# EAGLE schematic ram (EAGLE 9.0.0)

## Sheet 1 of 2
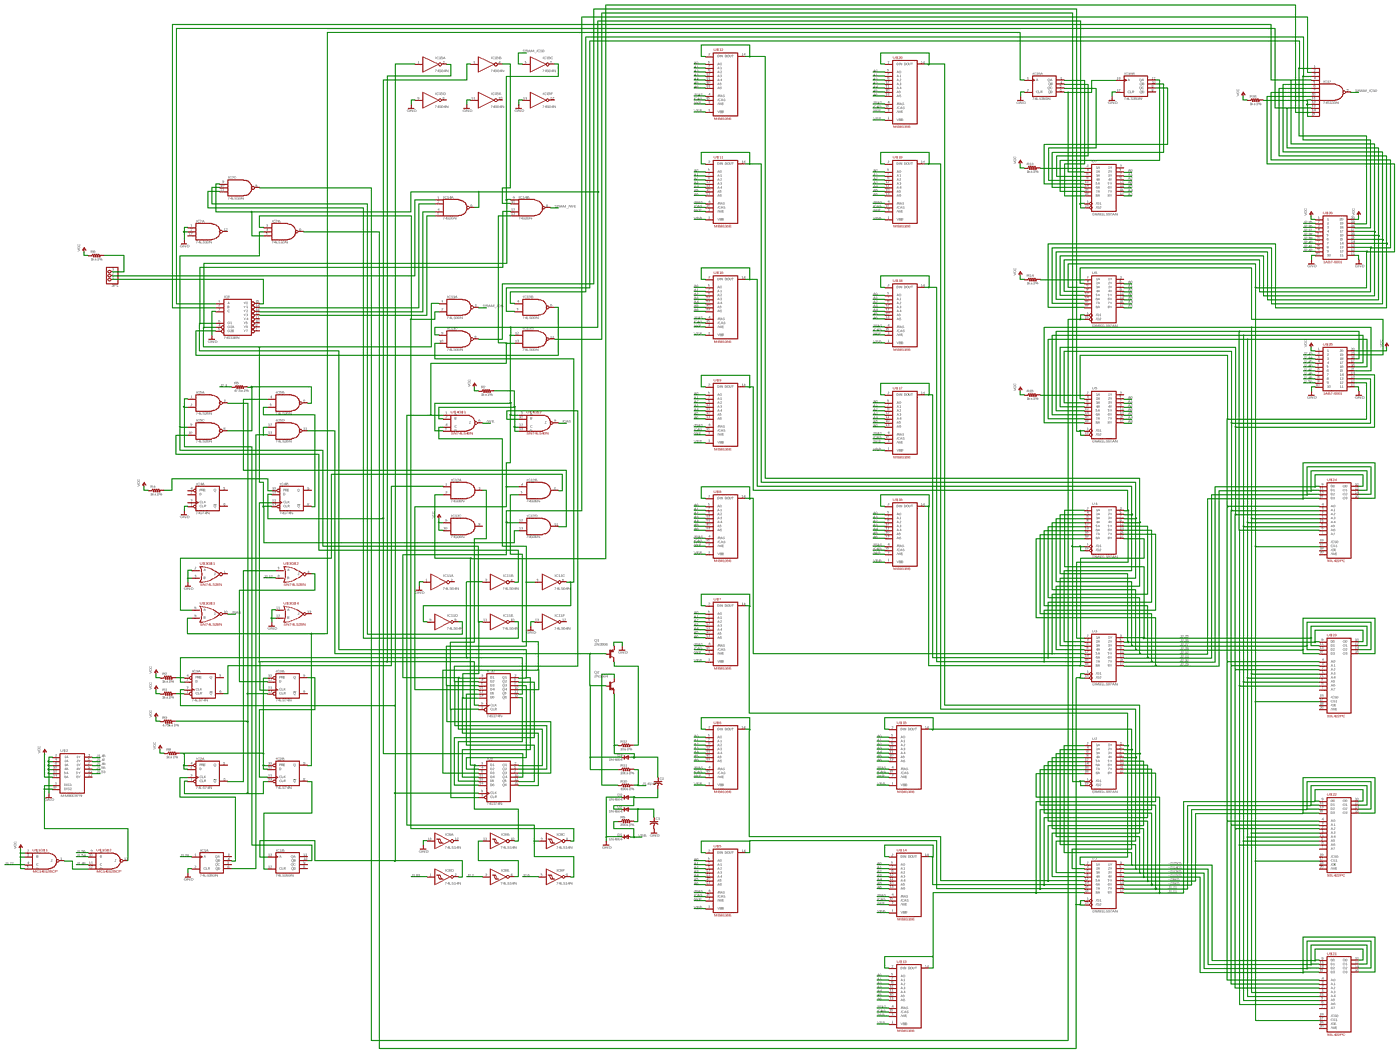
[diagram p0: schematic, sheet 1, overview]
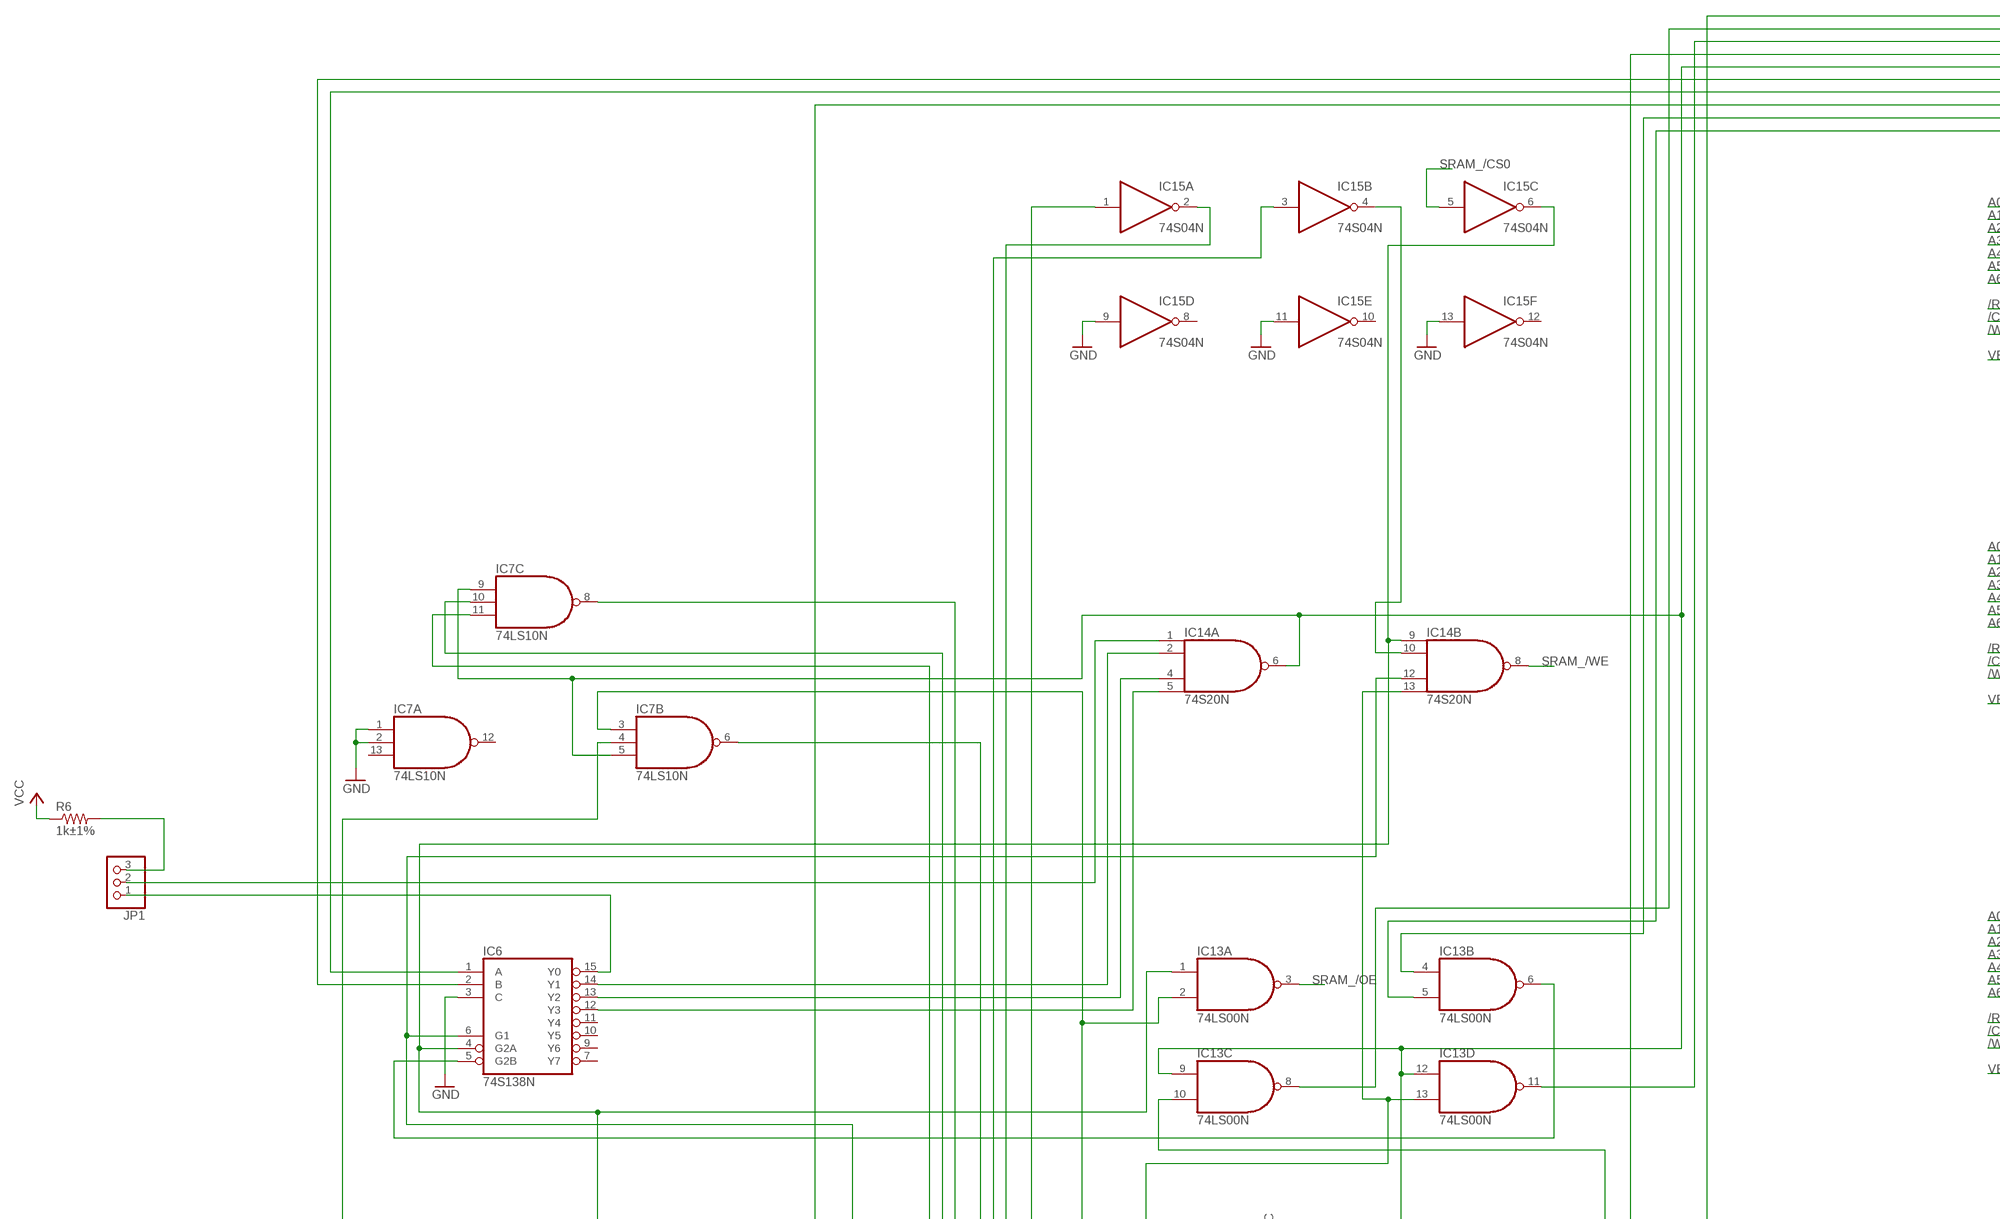
[diagram p1: schematic, sheet 1, part 1 of 4]
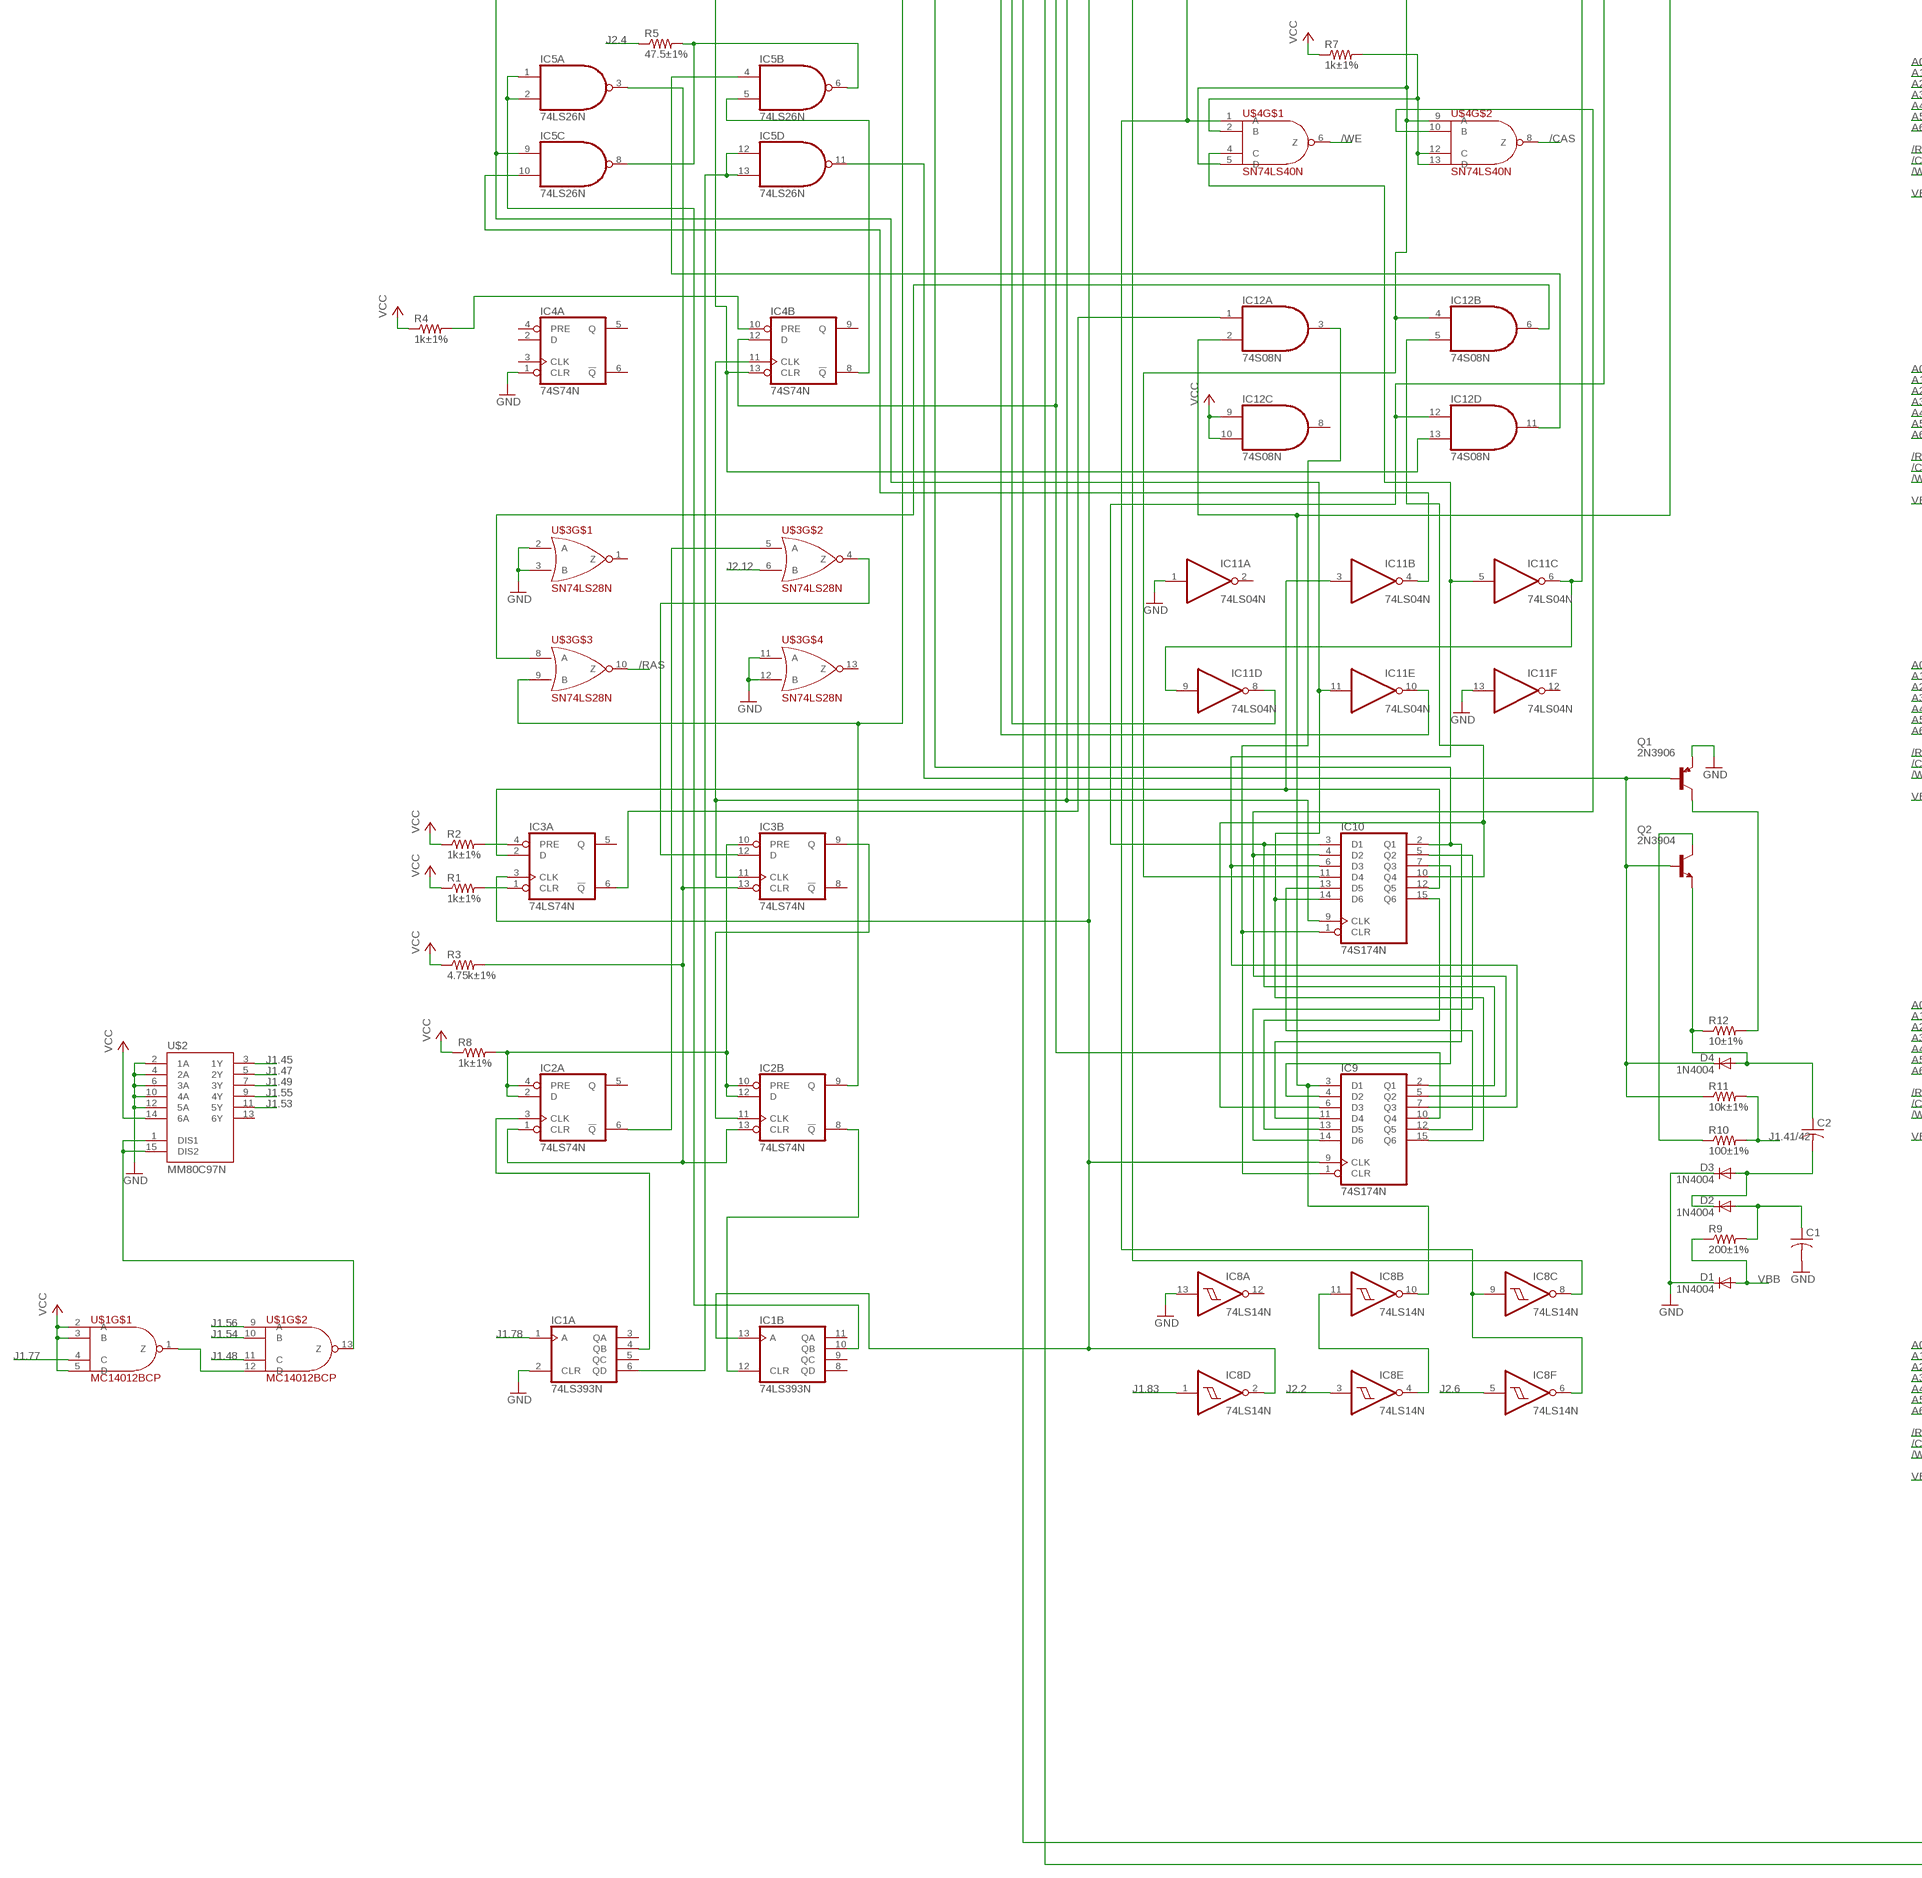
[diagram p2: schematic, sheet 1, part 2 of 4]
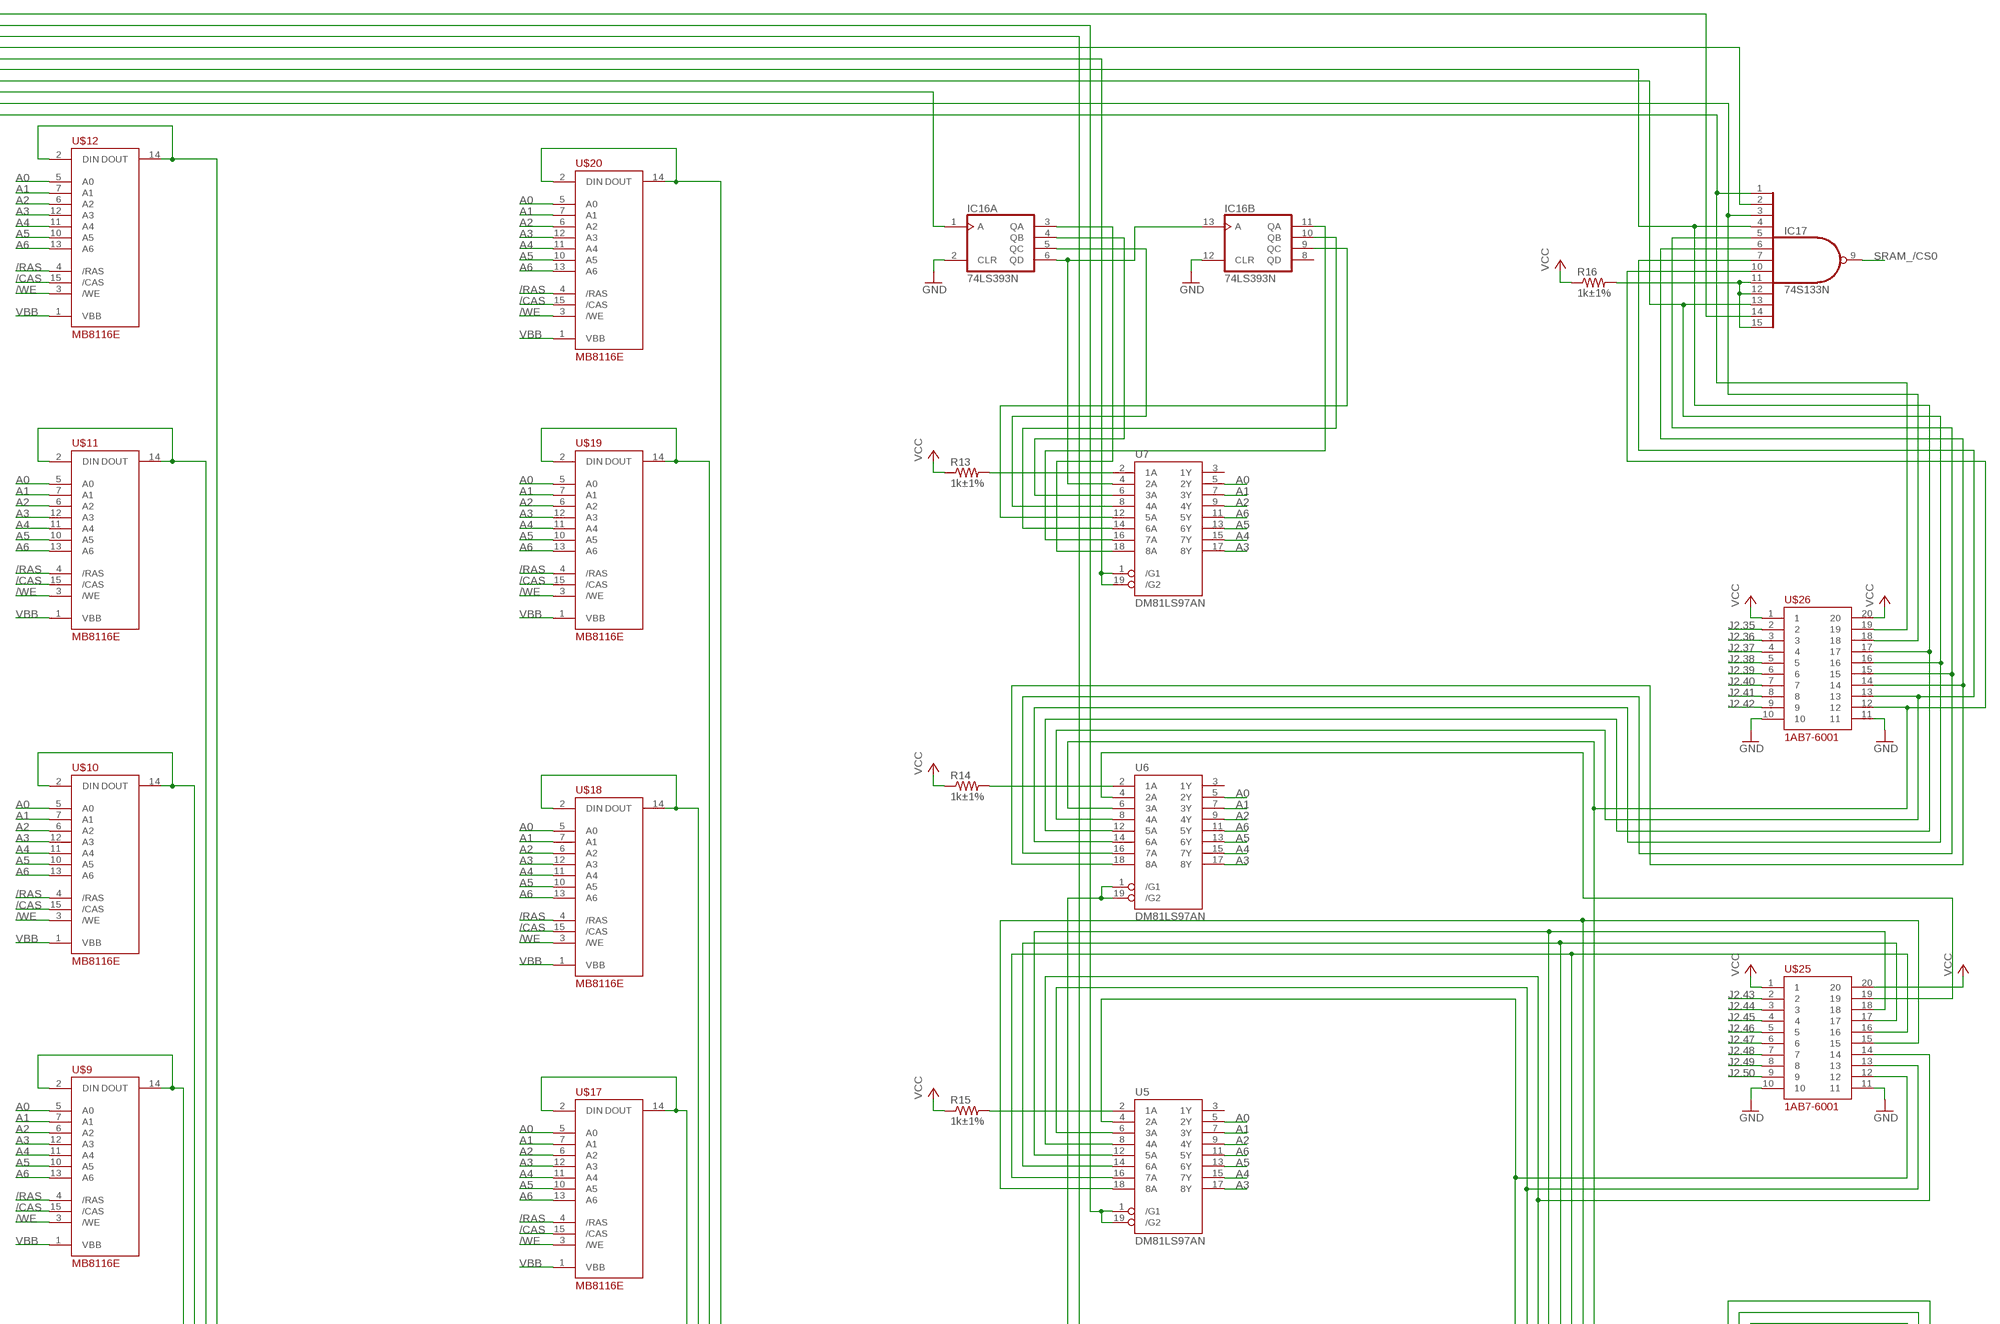
[diagram p3: schematic, sheet 1, part 3 of 4]
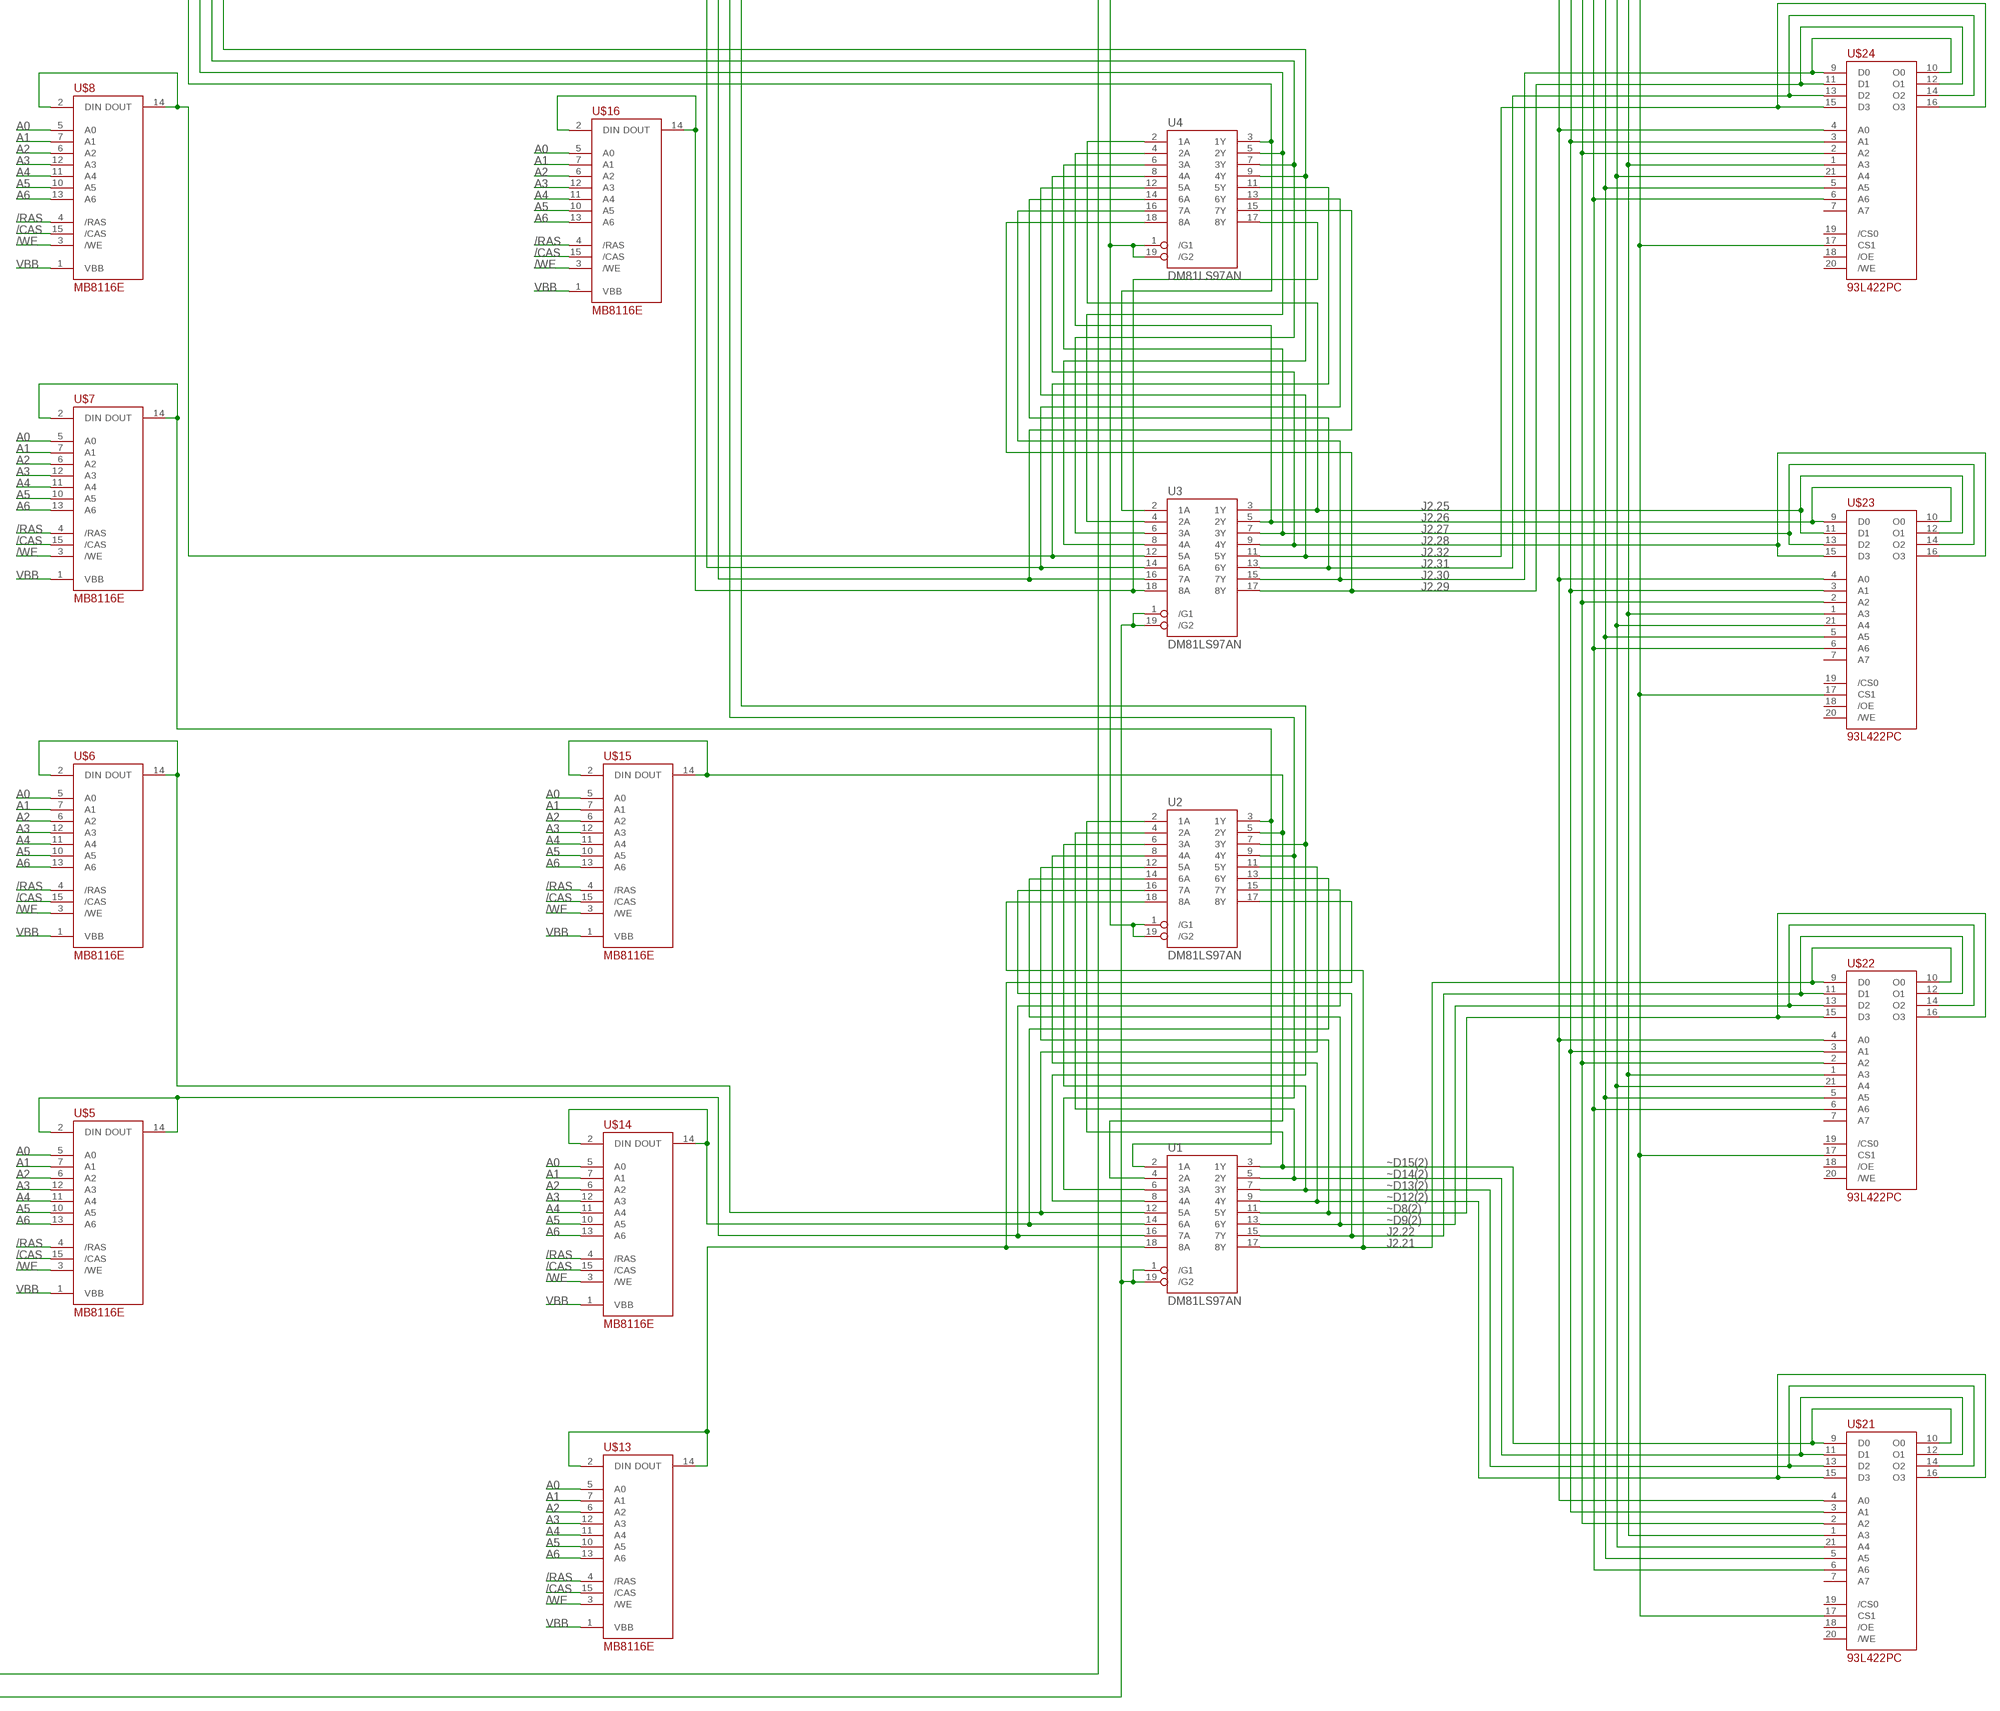
[diagram p4: schematic, sheet 1, part 4 of 4]

### Parts
C1  C-US075-032X103  [C075-032X103]
C2  C-US075-032X103  [C075-032X103]
D1  1N4004  [DO41-10]
D2  1N4004  [DO41-10]
D3  1N4004  [DO41-10]
D4  1N4004  [DO41-10]
IC1  74LS393N  [DIL14]
IC2  74LS74N  [DIL14]
IC3  74LS74N  [DIL14]
IC4  74S74N  [DIL14]
IC5  74LS26N  [DIL14]
IC6  74S138N  [DIL16]
IC7  74LS10N  [DIL14]
IC8  74LS14N  [DIL14]
IC9  74S174N  [DIL16]
IC10  74S174N  [DIL16]
IC11  74LS04N  [DIL14]
IC12  74S08N  [DIL14]
IC13  74LS00N  [DIL14]
IC14  74S20N  [DIL14]
IC15  74S04N  [DIL14]
IC16  74LS393N  [DIL14]
IC17  74S133N  [DIL16]
JP1  PINHD-1X3  [1X03]
Q1  2N3906  [TO92]
Q2  2N3904  [TO92]
R1  1k±1%  R-US_0207/7  [0207/7]
R2  1k±1%  R-US_0207/7  [0207/7]
R3  4.75k±1%  R-US_0207/7  [0207/7]
R4  1k±1%  R-US_0207/7  [0207/7]
R5  47.5±1%  R-US_0207/7  [0207/7]
R6  1k±1%  R-US_0207/7  [0207/7]
R7  1k±1%  R-US_0207/7  [0207/7]
R8  1k±1%  R-US_0207/7  [0207/7]
R9  200±1%  R-US_0207/7  [0207/7]
R10  100±1%  R-US_0207/7  [0207/7]
R11  10k±1%  R-US_0207/7  [0207/7]
R12  10±1%  R-US_0207/7  [0207/7]
R13  1k±1%  R-US_0207/7  [0207/7]
R14  1k±1%  R-US_0207/7  [0207/7]
R15  1k±1%  R-US_0207/7  [0207/7]
R16  1k±1%  R-US_0207/7  [0207/7]
U1  DM81LS97AN  [DIL20]
U2  DM81LS97AN  [DIL20]
U3  DM81LS97AN  [DIL20]
U4  DM81LS97AN  [DIL20]
U5  DM81LS97AN  [DIL20]
U6  DM81LS97AN  [DIL20]
U7  DM81LS97AN  [DIL20]
U$1  MC14012BCP  [DIL14]
U$2  MM80C97N  [DIL16]
U$3  SN74LS28N  [DIL14]
U$4  SN74LS40N  [DIL14]
U$5  MB8116E  [DIL16]
U$6  MB8116E  [DIL16]
U$7  MB8116E  [DIL16]
U$8  MB8116E  [DIL16]
U$9  MB8116E  [DIL16]
U$10  MB8116E  [DIL16]
U$11  MB8116E  [DIL16]
U$12  MB8116E  [DIL16]
U$13  MB8116E  [DIL16]
U$14  MB8116E  [DIL16]
U$15  MB8116E  [DIL16]
U$16  MB8116E  [DIL16]
U$17  MB8116E  [DIL16]
U$18  MB8116E  [DIL16]
U$19  MB8116E  [DIL16]
U$20  MB8116E  [DIL16]
U$21  93L422PC  [DIL22]
U$22  93L422PC  [DIL22]
U$23  93L422PC  [DIL22]
U$24  93L422PC  [DIL22]
U$25  1AB7-6001  [DIL20]
U$26  1AB7-6001  [DIL20]

### Nets
/CAS: U$4.8(Z) U$5.15(/CAS) ; also sheet 2
/RAS: U$3.10(Z) U$5.4(/RAS) ; also sheet 2
/WE: U$4.6(Z) U$5.3(/WE) ; also sheet 2
A0: U5.5(2Y) U6.5(2Y) U7.5(2Y) U$5.5(A0) ; also sheet 2
A1: U5.7(3Y) U6.7(3Y) U7.7(3Y) U$5.7(A1) ; also sheet 2
A2: U5.9(4Y) U6.9(4Y) U7.9(4Y) U$5.6(A2) ; also sheet 2
A3: U5.17(8Y) U6.17(8Y) U7.17(8Y) U$5.12(A3) ; also sheet 2
A4: U5.15(7Y) U6.15(7Y) U7.15(7Y) U$5.11(A4) ; also sheet 2
A5: U5.13(6Y) U6.13(6Y) U7.13(6Y) U$5.10(A5) ; also sheet 2
A6: U5.11(5Y) U6.11(5Y) U7.11(5Y) U$5.13(A6) ; also sheet 2
GND: D1.C D3.C IC1.2(A:CLR) IC4.1(A:CLR) IC6.3(C) IC7.1(A:I0) IC7.2(A:I1) IC8.13(A:I) IC11.1(A:I) IC11.13(F:I) IC15.9(D:I) IC15.11(E:I) IC15.13(F:I) IC16.2(A:CLR) IC16.12(B:CLR) Q1.3(E) U$2.2(1A) U$2.4(2A) U$2.6(3A) U$2.10(4A) U$2.12(5A) U$3.2(A) U$3.3(B) U$3.11(A) U$3.12(B) U$25.11 U$26.11 ; also sheet 2
J1.41/42: R10.2 R11.2
J1.45: U$2.3(1Y)
J1.47: U$2.5(2Y)
J1.48: U$1.11(C)
J1.49: U$2.7(3Y)
J1.53: U$2.11(5Y)
J1.54: U$1.10(B)
J1.55: U$2.9(4Y)
J1.56: U$1.9(A)
J1.77: U$1.4(C)
J1.78: IC1.1(A:A)
J1.83: IC8.1(D:I)
J2.2: IC8.3(E:I)
J2.4: R5.1
J2.6: IC8.5(F:I)
J2.12: U$3.6(B) ; also sheet 2
J2.21: U1.17(8Y) U2.18(8A)
J2.22: U1.15(7Y) U2.16(7A)
J2.25: U3.3(1Y) U4.2(1A)
J2.26: U3.5(2Y) U4.4(2A)
J2.27: U3.7(3Y) U4.6(3A)
J2.28: U3.9(4Y) U4.8(4A)
J2.29: U3.17(8Y) U4.18(8A)
J2.30: U3.15(7Y) U4.16(7A)
J2.31: U3.13(6Y) U4.14(6A)
J2.32: U3.11(5Y) U4.12(5A)
J2.35: U$26.2
J2.36: U$26.3
J2.37: U$26.4
J2.38: U$26.5
J2.39: U$26.6
J2.40: U$26.7
J2.41: U$26.8
J2.42: U$26.9
J2.43: U$25.2
J2.44: U$25.3
J2.45: U$25.4
J2.46: U$25.5
J2.47: U$25.6
J2.48: U$25.7
J2.49: U$25.8
J2.50: U$25.9
N$1: U$1.1(Z) U$1.12(D)
N$2: IC7.6(B:O) U1.1(/G1) U1.19(/G2) U3.1(/G1) U3.19(/G2)
N$3: U$1.13(Z) U$2.1(DIS1) U$2.15(DIS2)
N$4: IC2.2(A:D) IC2.4(A:PRE) IC2.10(B:PRE) IC2.12(B:D) IC3.10(B:PRE) R8.2
N$5: U$25.10
N$6: IC8.10(B:O) IC9.3(D1) IC12.2(A:I1) IC17.14(I11)
N$7: IC2.1(A:CLR) IC2.13(B:CLR) IC3.13(B:CLR) IC5.3(A:O) R3.2
N$8: IC13.11(D:O) U2.1(/G1) U2.19(/G2) U4.1(/G1) U4.19(/G2)
N$9: IC1.10(B:QB) IC5.1(A:I0) IC5.2(A:I1)
N$10: IC5.6(B:O) IC5.8(C:O) R5.2
N$11: IC1.6(A:QD) IC5.12(D:I0) IC5.13(D:I1)
N$12: IC13.8(C:O) U5.1(/G1) U5.19(/G2)
N$13: IC7.8(C:O) U6.1(/G1) U6.19(/G2)
N$14: IC7.5(B:I2) IC7.9(C:I0) IC10.11(D4) IC12.4(B:I0) IC13.9(C:I0) IC13.12(D:I0) IC14.6(A:O) U7.1(/G1) U7.19(/G2) U$4.5(D) U$4.9(A)
N$15: IC8.4(E:O) IC8.11(B:I)
N$16: IC8.6(F:O) IC8.9(C:I) IC13.13(D:I1) IC14.13(B:I3) U$4.1(A)
N$17: IC14.10(B:I1) IC15.4(B:O)
N$18: IC17.10(I7) U6.6(3A) U$21.17(CS1) U$22.17(CS1) U$23.17(CS1) U$24.17(CS1) U$26.12
N$19: IC17.11(I8) IC17.12(I9) IC17.15(I12) R16.2
N$20: IC11.6(C:O) IC11.9(D:I) IC13.10(C:I1)
N$21: R13.2 U7.2(1A)
N$22: R7.2 U$4.2(B) U$4.12(C) U$4.13(D)
N$23: IC13.4(B:I0) IC17.3(I2) U$26.18
N$24: IC13.5(B:I1) IC17.1(I0) U$26.19
N$26: U$26.10
N$41: IC17.7(I6) U6.8(4A) U$26.13
N$42: IC1.12(B:CLR) IC2.8(B:!Q)
N$43: IC1.13(B:A) IC3.3(A:CLK) IC8.2(D:O) IC9.9(CLK) IC15.1(A:I)
N$44: IC12.6(B:O) U$3.8(A)
N$45: IC1.4(A:QB) IC2.3(A:CLK)
N$46: IC2.9(B:Q) IC16.1(A:A) U$3.9(B)
N$47: IC4.8(B:!Q) IC5.5(B:I1)
N$48: IC2.11(B:CLK) IC3.9(B:Q)
N$49: IC2.6(A:!Q) U$3.5(A)
N$50: IC3.1(A:CLR) R1.2
N$51: R2.2
N$52: IC3.6(A:!Q) IC12.1(A:I0)
N$53: IC3.11(B:CLK) IC4.11(B:CLK) IC10.9(CLK) IC15.2(A:O)
N$54: IC4.10(B:PRE) R4.2
N$55: IC3.12(B:D) U$3.4(Z)
N$56: IC3.2(A:D) IC10.12(Q5) IC11.3(B:I)
N$57: IC4.12(B:D) IC9.10(Q4) IC15.3(B:I)
N$58: IC5.9(C:I0) IC7.4(B:I1) IC9.15(Q6) IC10.14(D6) IC11.11(E:I)
N$59: IC4.13(B:CLR) IC6.4(G2A) IC12.13(D:I1) IC13.1(A:I0) IC14.9(B:I0) IC15.6(C:O)
N$60: IC5.4(B:I0) IC12.11(D:O)
N$61: IC5.10(C:I1) IC11.4(B:O)
N$62: D4.C IC5.11(D:O) Q1.2(B) Q2.2(B) R11.1
N$63: IC7.10(C:I1) IC11.8(D:O)
N$66: IC7.11(C:I2) IC11.10(E:O)
N$67: IC9.4(D2) IC10.7(Q3)
N$68: IC6.5(G2B) IC13.6(B:O)
N$69: U1.16(7A) U2.15(7Y) U$5.2(DIN) U$5.14(DOUT)
N$70: IC6.6(G1) IC9.11(D4) IC10.2(Q1) IC14.12(B:I2)
N$71: IC6.12(Y3) IC14.5(A:I3)
N$72: IC6.13(Y2) IC14.4(A:I2)
N$73: IC6.14(Y1) IC14.2(A:I1)
N$74: IC6.15(Y0) JP1.1
N$75: IC14.1(A:I0) JP1.2
N$76: JP1.3 R6.2
N$77: IC9.12(Q5) IC10.13(D5)
N$78: IC7.3(B:I0) IC8.8(C:O) IC13.2(A:I1)
N$79: IC9.13(D5) IC10.15(Q6)
N$80: U1.12(5A) U2.11(5Y)
N$81: U1.2(1A) U2.3(1Y)
N$82: IC9.1(CLR) IC10.1(CLR) IC12.3(A:O)
N$83: IC9.2(Q1) IC10.3(D1) IC12.12(D:I0) IC17.2(I1)
N$84: IC9.5(Q2) IC10.4(D2) U$4.10(B)
N$85: IC9.7(Q3) IC10.6(D3) IC11.5(C:I) U$4.4(C)
N$86: IC9.6(D3) IC10.10(Q4) IC12.5(B:I1)
N$87: IC9.14(D6) IC10.5(Q2)
N$88: U3.12(5A) U4.11(5Y)
N$89: U3.2(1A) U4.3(1Y)
N$91: U3.6(3A) U4.7(3Y)
N$92: U3.8(4A) U4.9(4Y)
N$93: U1.18(8A) U2.17(8Y)
N$94: U1.14(6A) U2.13(6Y)
N$95: U1.4(2A) U2.5(2Y)
N$96: U3.18(8A) U4.17(8Y)
N$97: U3.14(6A) U4.13(6Y)
N$98: U3.16(7A) U4.15(7Y)
N$99: U1.6(3A) U2.9(4Y)
N$100: U1.8(4A) U2.7(3Y)
N$101: C2.1 D4.A Q2.3(E) R12.1
N$102: C1.1 D2.A R9.2
N$103: C2.2 D2.C D3.A
N$104: IC16.6(A:QD) IC16.13(B:A) U7.4(2A)
N$105: IC16.3(A:QA) U7.18(8A)
N$106: Q2.1(C) R10.1
N$107: Q1.1(C) R12.2
N$108: IC16.11(B:QA) U7.16(7A)
N$109: IC16.4(A:QB) U7.6(3A)
N$110: IC16.10(B:QB) U7.14(6A)
N$111: IC16.5(A:QC) U7.8(4A)
N$112: IC16.9(B:QC) U7.12(5A)
N$113: R14.2
N$114: U6.4(2A) U$25.19
N$115: IC6.2(B) IC17.4(I3) U6.12(5A) U$26.17
N$116: IC6.1(A) IC17.13(I10) U6.14(6A) U$26.16
N$117: IC17.5(I4) U6.16(7A) U$26.15
N$118: IC17.6(I5) U6.18(8A) U$26.14
N$119: R15.2
N$120: U5.4(2A) U$21.4(A0) U$22.4(A0) U$23.4(A0) U$24.4(A0) U$25.12
N$121: U5.6(3A) U$21.3(A1) U$22.3(A1) U$23.3(A1) U$24.3(A1) U$25.13
N$123: U5.8(4A) U$21.2(A2) U$22.2(A2) U$23.2(A2) U$24.2(A2) U$25.14
N$124: U5.12(5A) U$21.6(A6) U$22.6(A6) U$23.6(A6) U$24.6(A6) U$25.18
N$125: U5.14(6A) U$21.5(A5) U$22.5(A5) U$23.5(A5) U$24.5(A5) U$25.17
N$126: U5.16(7A) U$21.21(A4) U$22.21(A4) U$23.21(A4) U$24.21(A4) U$25.16
N$127: U5.18(8A) U$21.1(A3) U$22.1(A3) U$23.1(A3) U$24.1(A3) U$25.15
N$130: U3.4(2A) U4.5(2Y)
SRAM_/CS0: IC15.5(C:I) IC17.9(O) ; also sheet 2
SRAM_/OE: IC13.3(A:O) ; also sheet 2
SRAM_/WE: IC14.8(B:O) ; also sheet 2
VBB: D1.A R9.1 U$5.1(VBB) ; also sheet 2
VCC: IC12.9(C:I0) IC12.10(C:I1) R1.1 R2.1 R3.1 R4.1 R6.1 R7.1 R8.1 R13.1 R14.1 R15.1 R16.1 U$1.2(A) U$1.3(B) U$1.5(D) U$2.14(6A) U$25.1 U$25.20 U$26.1 U$26.20 ; also sheet 2
~D8(2): U1.11(5Y) U2.12(5A) ; also sheet 2
~D9(2): U1.13(6Y) U2.14(6A) ; also sheet 2
~D12(2): U1.9(4Y) U2.8(4A) U$21.15(D3) U$21.16(O3) ; also sheet 2
~D13(2): U1.7(3Y) U2.6(3A) U$21.13(D2) U$21.14(O2) ; also sheet 2
~D14(2): U1.5(2Y) U2.4(2A) U$21.11(D1) U$21.12(O1) ; also sheet 2
~D15(2): U1.3(1Y) U2.2(1A) U$21.9(D0) U$21.10(O0) ; also sheet 2
Unconnected: C1.2 IC1.3(A:QA) IC1.5(A:QC) IC1.8(B:QD) IC1.9(B:QC) IC1.11(B:QA) IC2.5(A:Q) IC3.4(A:PRE) IC3.5(A:Q) IC3.8(B:!Q) IC4.2(A:D) IC4.3(A:CLK) IC4.4(A:PRE) IC4.5(A:Q) IC4.6(A:!Q) IC4.9(B:Q) IC6.7(Y7) IC6.9(Y6) IC6.10(Y5) IC6.11(Y4) IC7.12(A:O) IC7.13(A:I2) IC8.12(A:O) IC11.2(A:O) IC11.12(F:O) IC12.8(C:O) IC15.8(D:O) IC15.10(E:O) IC15.12(F:O) IC16.8(B:QD) U5.2(1A) U5.3(1Y) U6.2(1A) U6.3(1Y) U7.3(1Y) U$2.13(6Y) U$3.1(Z) U$3.13(Z) U$6.1(VBB) U$6.2(DIN) U$6.3(/WE) U$6.4(/RAS) U$6.5(A0) U$6.6(A2) U$6.7(A1) U$6.10(A5) U$6.11(A4) U$6.12(A3) U$6.13(A6) U$6.14(DOUT) U$6.15(/CAS) U$7.1(VBB) U$7.2(DIN) U$7.3(/WE) U$7.4(/RAS) U$7.5(A0) U$7.6(A2) U$7.7(A1) U$7.10(A5) U$7.11(A4) U$7.12(A3) U$7.13(A6) U$7.14(DOUT) U$7.15(/CAS) U$8.1(VBB) U$8.2(DIN) U$8.3(/WE) U$8.4(/RAS) U$8.5(A0) U$8.6(A2) U$8.7(A1) U$8.10(A5) U$8.11(A4) U$8.12(A3) U$8.13(A6) U$8.14(DOUT) U$8.15(/CAS) U$9.1(VBB) U$9.2(DIN) U$9.3(/WE) U$9.4(/RAS) U$9.5(A0) U$9.6(A2) U$9.7(A1) U$9.10(A5) U$9.11(A4) U$9.12(A3) U$9.13(A6) U$9.14(DOUT) U$9.15(/CAS) U$10.1(VBB) U$10.2(DIN) U$10.3(/WE) U$10.4(/RAS) U$10.5(A0) U$10.6(A2) U$10.7(A1) U$10.10(A5) U$10.11(A4) U$10.12(A3) U$10.13(A6) U$10.14(DOUT) U$10.15(/CAS) U$11.1(VBB) U$11.2(DIN) U$11.3(/WE) U$11.4(/RAS) U$11.5(A0) U$11.6(A2) U$11.7(A1) U$11.10(A5) U$11.11(A4) U$11.12(A3) U$11.13(A6) U$11.14(DOUT) U$11.15(/CAS) U$12.1(VBB) U$12.2(DIN) U$12.3(/WE) U$12.4(/RAS) U$12.5(A0) U$12.6(A2) U$12.7(A1) U$12.10(A5) U$12.11(A4) U$12.12(A3) U$12.13(A6) U$12.14(DOUT) U$12.15(/CAS) U$13.1(VBB) U$13.2(DIN) U$13.3(/WE) U$13.4(/RAS) U$13.5(A0) U$13.6(A2) U$13.7(A1) U$13.10(A5) U$13.11(A4) U$13.12(A3) U$13.13(A6) U$13.14(DOUT) U$13.15(/CAS) U$14.1(VBB) U$14.2(DIN) U$14.3(/WE) U$14.4(/RAS) U$14.5(A0) U$14.6(A2) U$14.7(A1) U$14.10(A5) U$14.11(A4) U$14.12(A3) U$14.13(A6) U$14.14(DOUT) U$14.15(/CAS) U$15.1(VBB) U$15.2(DIN) U$15.3(/WE) U$15.4(/RAS) U$15.5(A0) U$15.6(A2) U$15.7(A1) U$15.10(A5) U$15.11(A4) U$15.12(A3) U$15.13(A6) U$15.14(DOUT) U$15.15(/CAS) U$16.1(VBB) U$16.2(DIN) U$16.3(/WE) U$16.4(/RAS) U$16.5(A0) U$16.6(A2) U$16.7(A1) U$16.10(A5) U$16.11(A4) U$16.12(A3) U$16.13(A6) U$16.14(DOUT) U$16.15(/CAS) U$17.1(VBB) U$17.2(DIN) U$17.3(/WE) U$17.4(/RAS) U$17.5(A0) U$17.6(A2) U$17.7(A1) U$17.10(A5) U$17.11(A4) U$17.12(A3) U$17.13(A6) U$17.14(DOUT) U$17.15(/CAS) U$18.1(VBB) U$18.2(DIN) U$18.3(/WE) U$18.4(/RAS) U$18.5(A0) U$18.6(A2) U$18.7(A1) U$18.10(A5) U$18.11(A4) U$18.12(A3) U$18.13(A6) U$18.14(DOUT) U$18.15(/CAS) U$19.1(VBB) U$19.2(DIN) U$19.3(/WE) U$19.4(/RAS) U$19.5(A0) U$19.6(A2) U$19.7(A1) U$19.10(A5) U$19.11(A4) U$19.12(A3) U$19.13(A6) U$19.14(DOUT) U$19.15(/CAS) U$20.1(VBB) U$20.2(DIN) U$20.3(/WE) U$20.4(/RAS) U$20.5(A0) U$20.6(A2) U$20.7(A1) U$20.10(A5) U$20.11(A4) U$20.12(A3) U$20.13(A6) U$20.14(DOUT) U$20.15(/CAS) U$21.7(A7) U$21.18(/OE) U$21.19(/CS0) U$21.20(/WE) U$22.7(A7) U$22.9(D0) U$22.10(O0) U$22.11(D1) U$22.12(O1) U$22.13(D2) U$22.14(O2) U$22.15(D3) U$22.16(O3) U$22.18(/OE) U$22.19(/CS0) U$22.20(/WE) U$23.7(A7) U$23.9(D0) U$23.10(O0) U$23.11(D1) U$23.12(O1) U$23.13(D2) U$23.14(O2) U$23.15(D3) U$23.16(O3) U$23.18(/OE) U$23.19(/CS0) U$23.20(/WE) U$24.7(A7) U$24.9(D0) U$24.10(O0) U$24.11(D1) U$24.12(O1) U$24.13(D2) U$24.14(O2) U$24.15(D3) U$24.16(O3) U$24.18(/OE) U$24.19(/CS0) U$24.20(/WE)

## Sheet 2 of 2
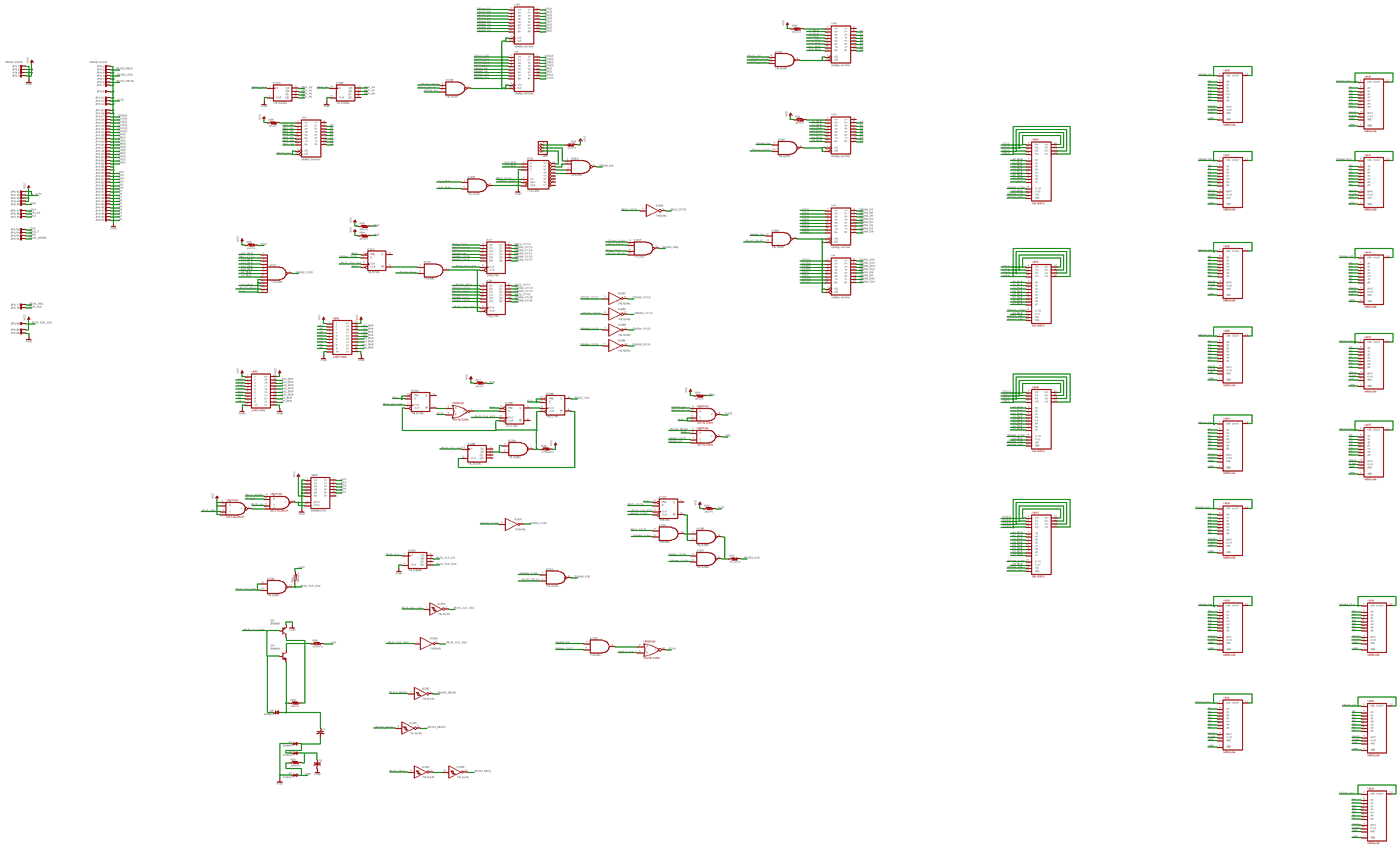
[diagram p5: schematic, sheet 2, overview]
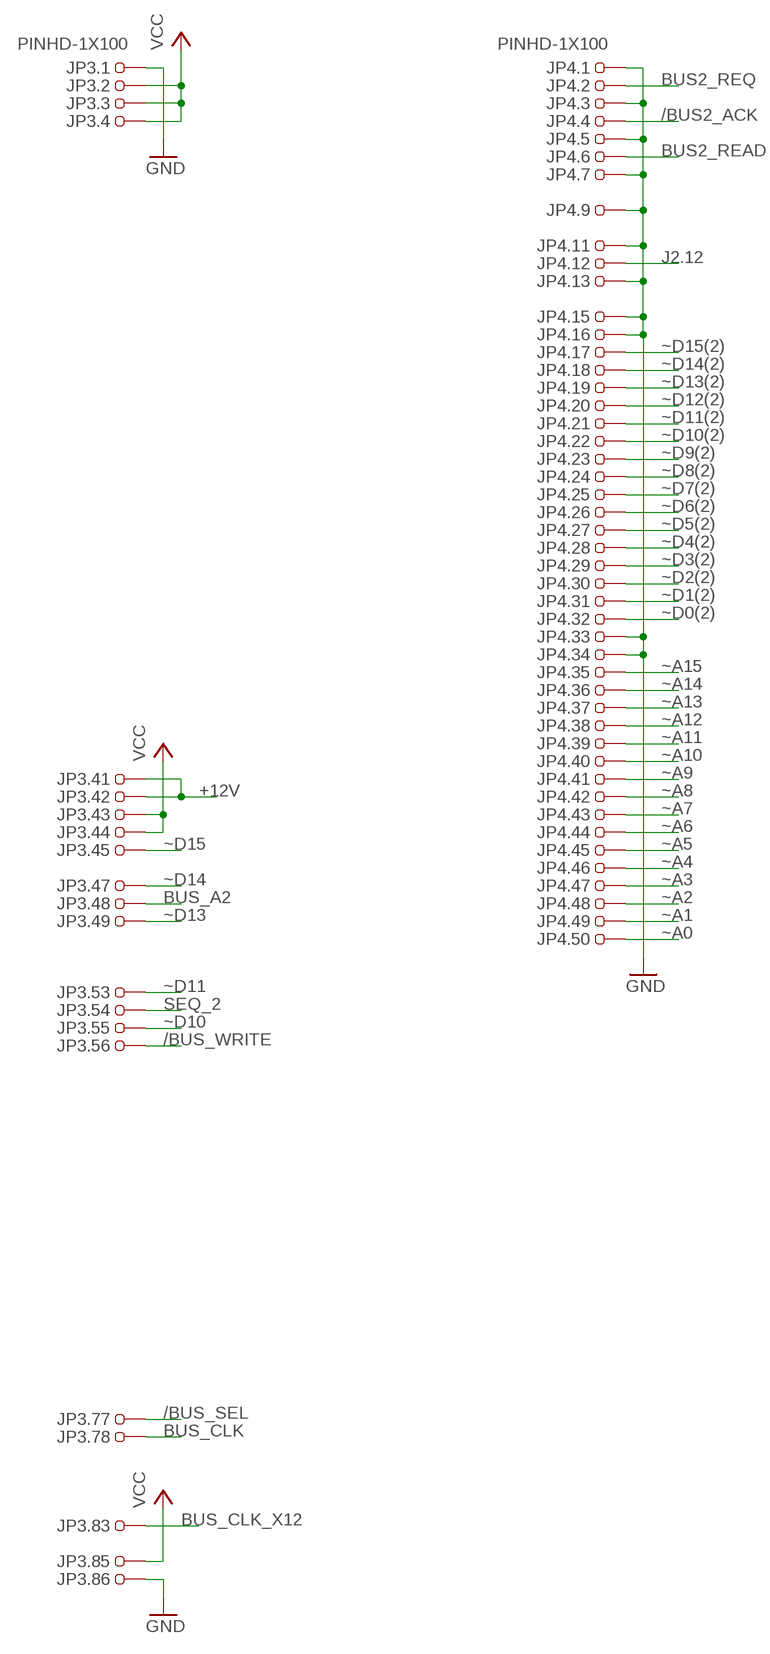
[diagram p6: schematic, sheet 2, part 1 of 7]
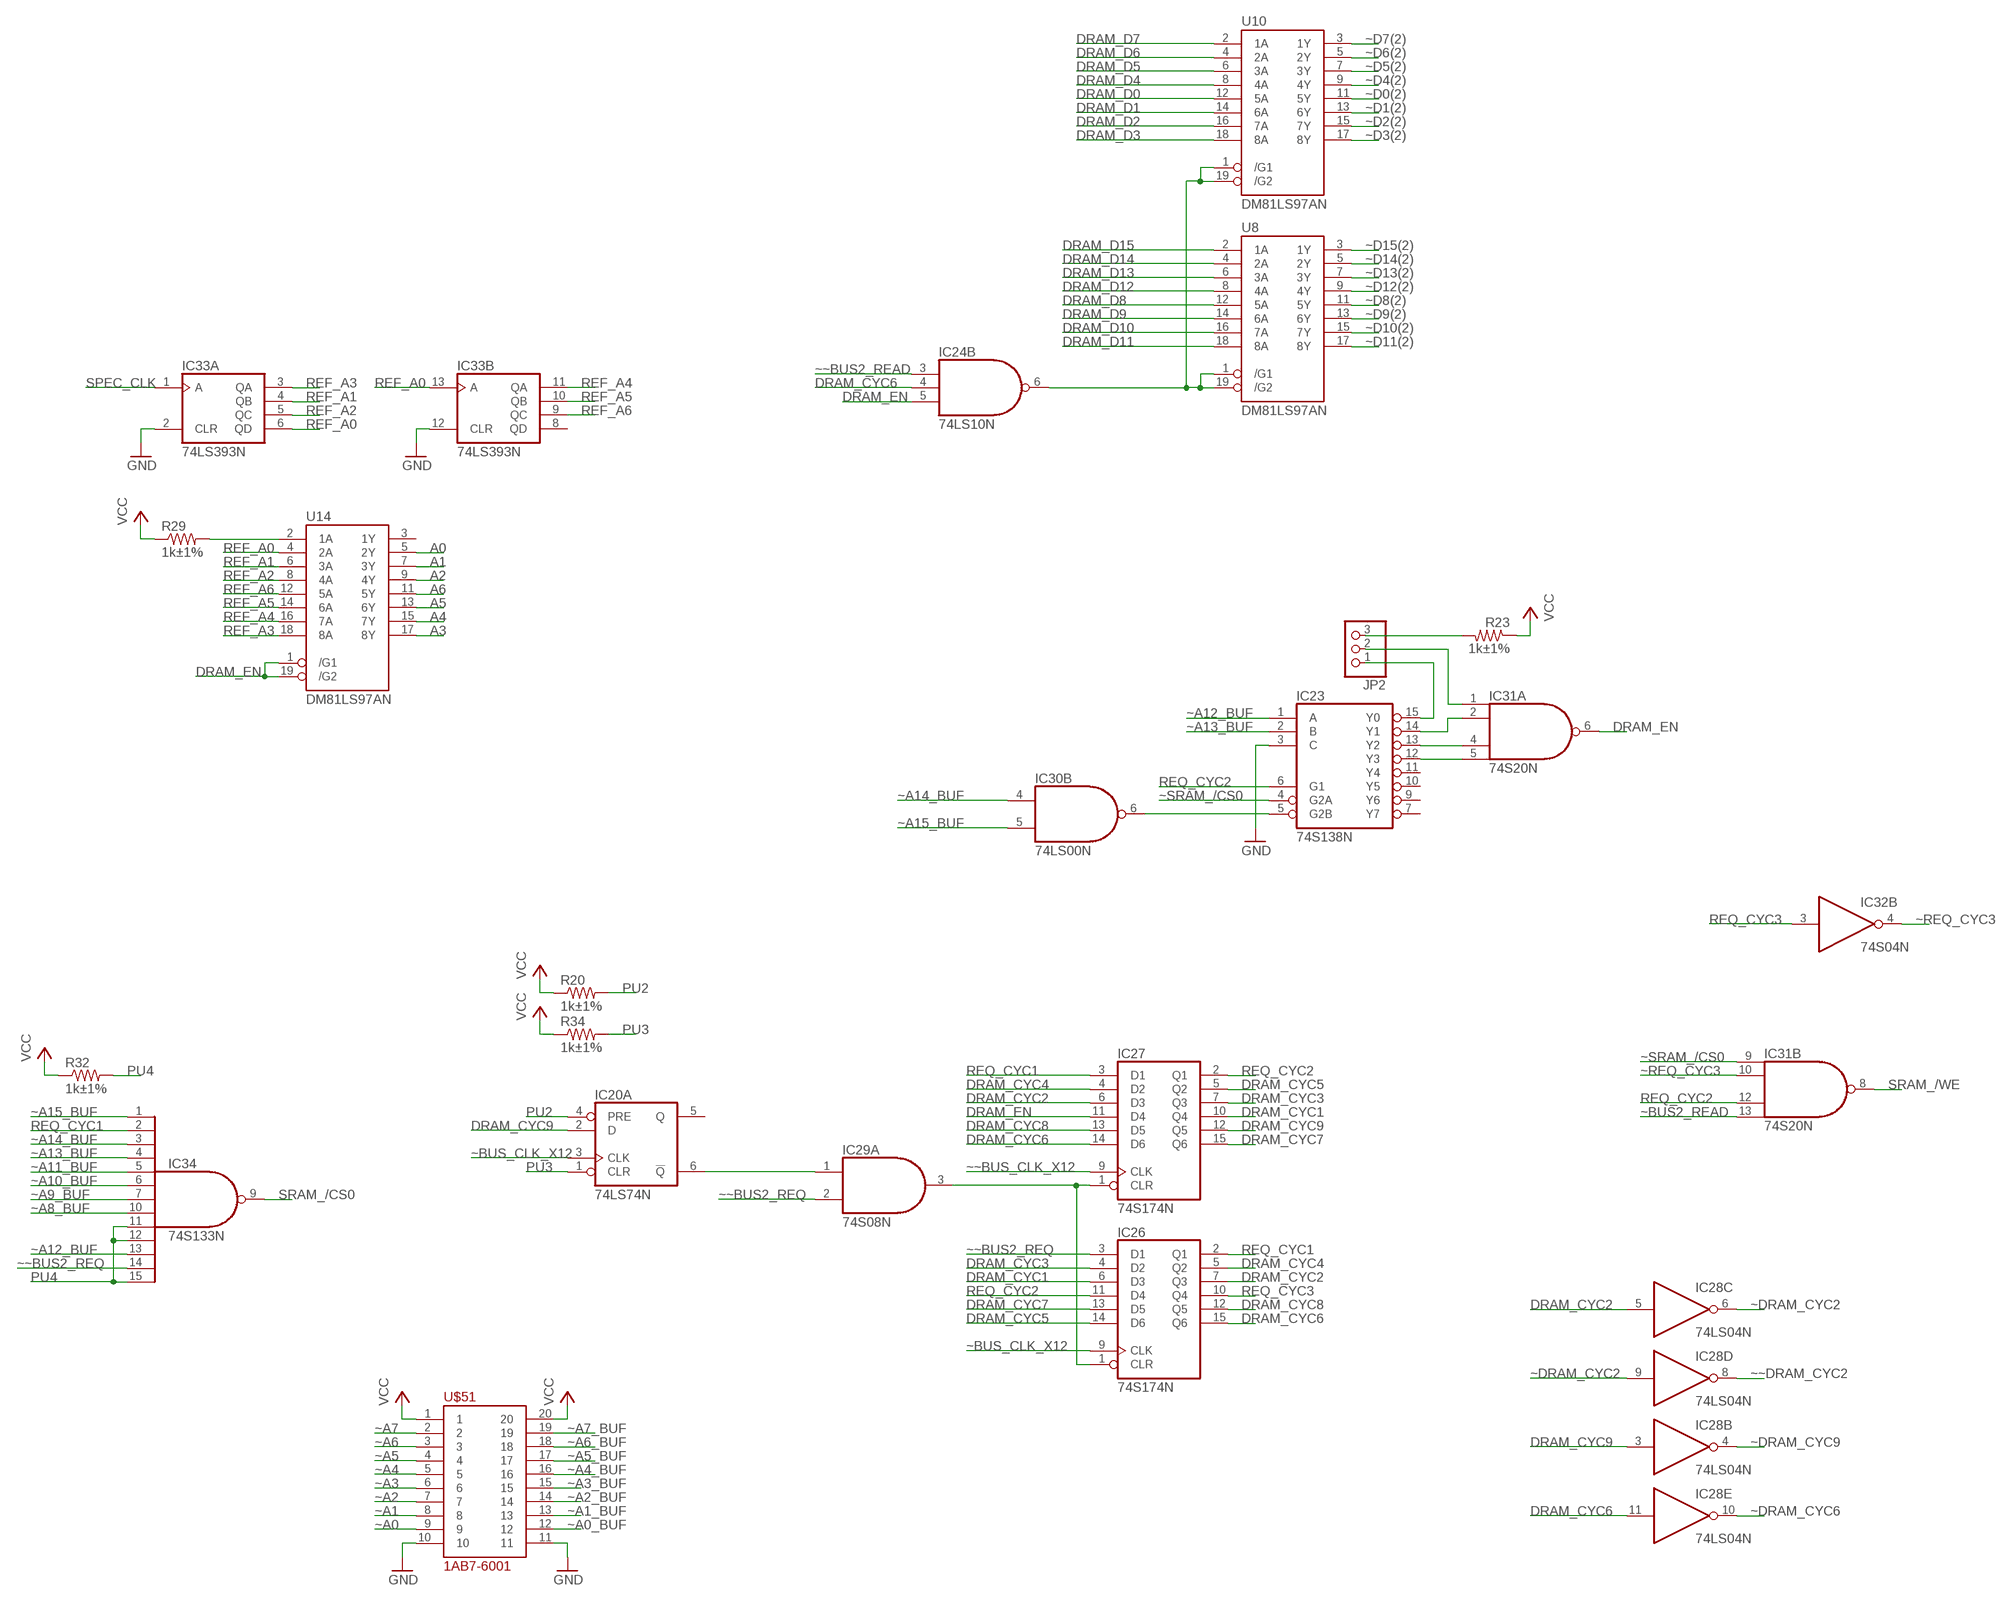
[diagram p7: schematic, sheet 2, part 2 of 7]
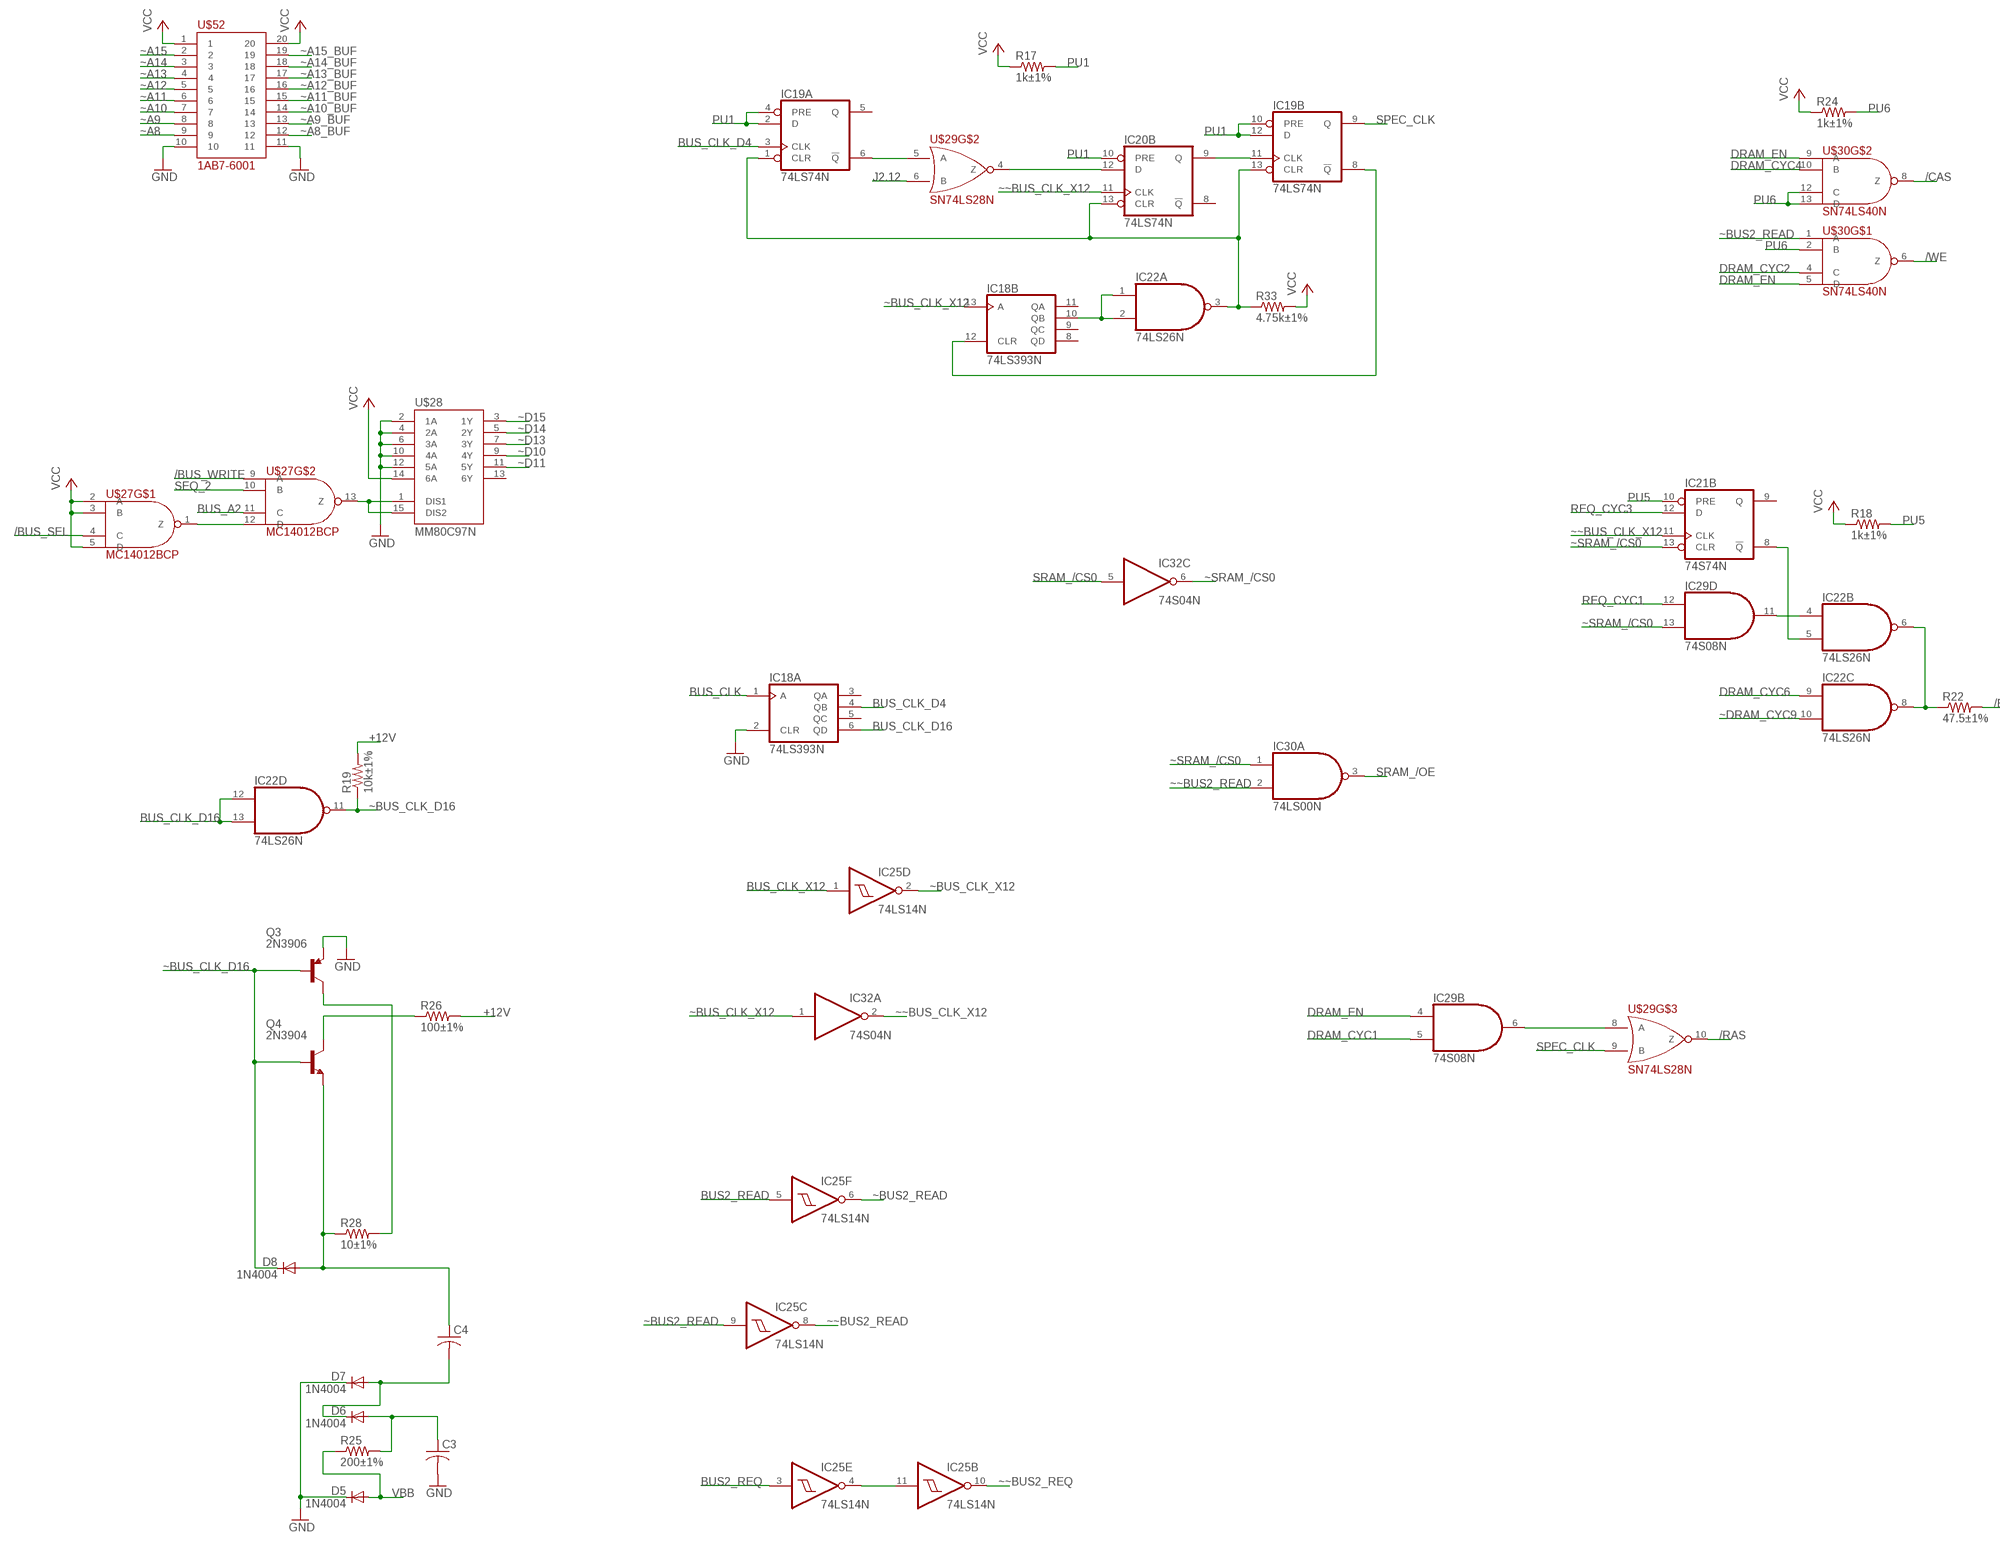
[diagram p8: schematic, sheet 2, part 3 of 7]
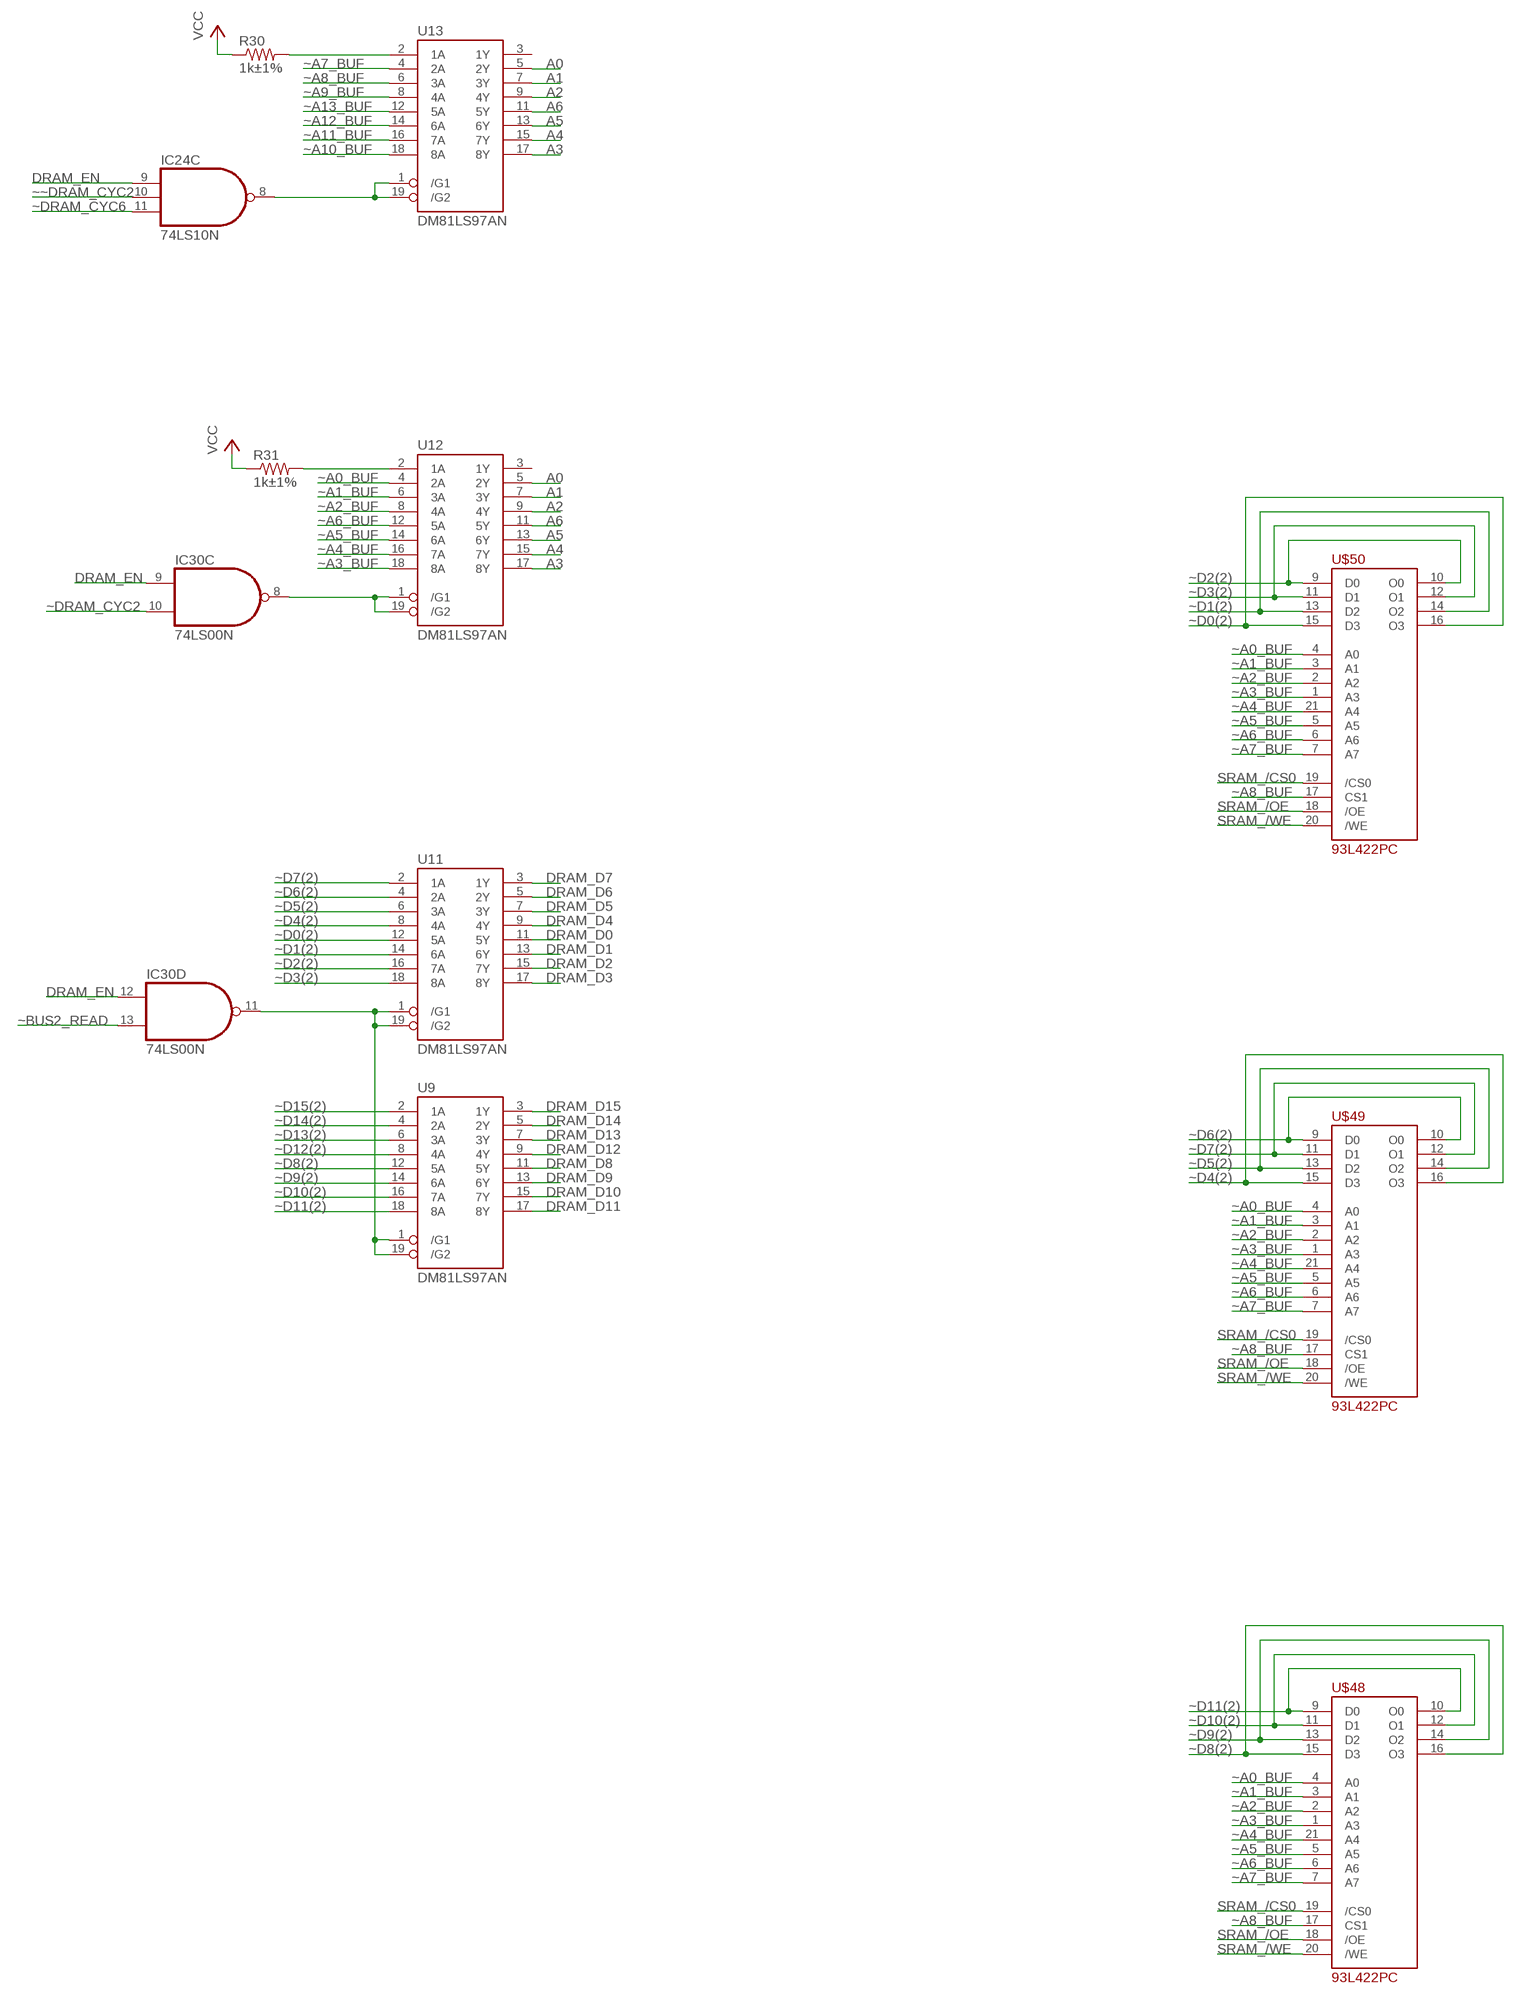
[diagram p9: schematic, sheet 2, part 4 of 7]
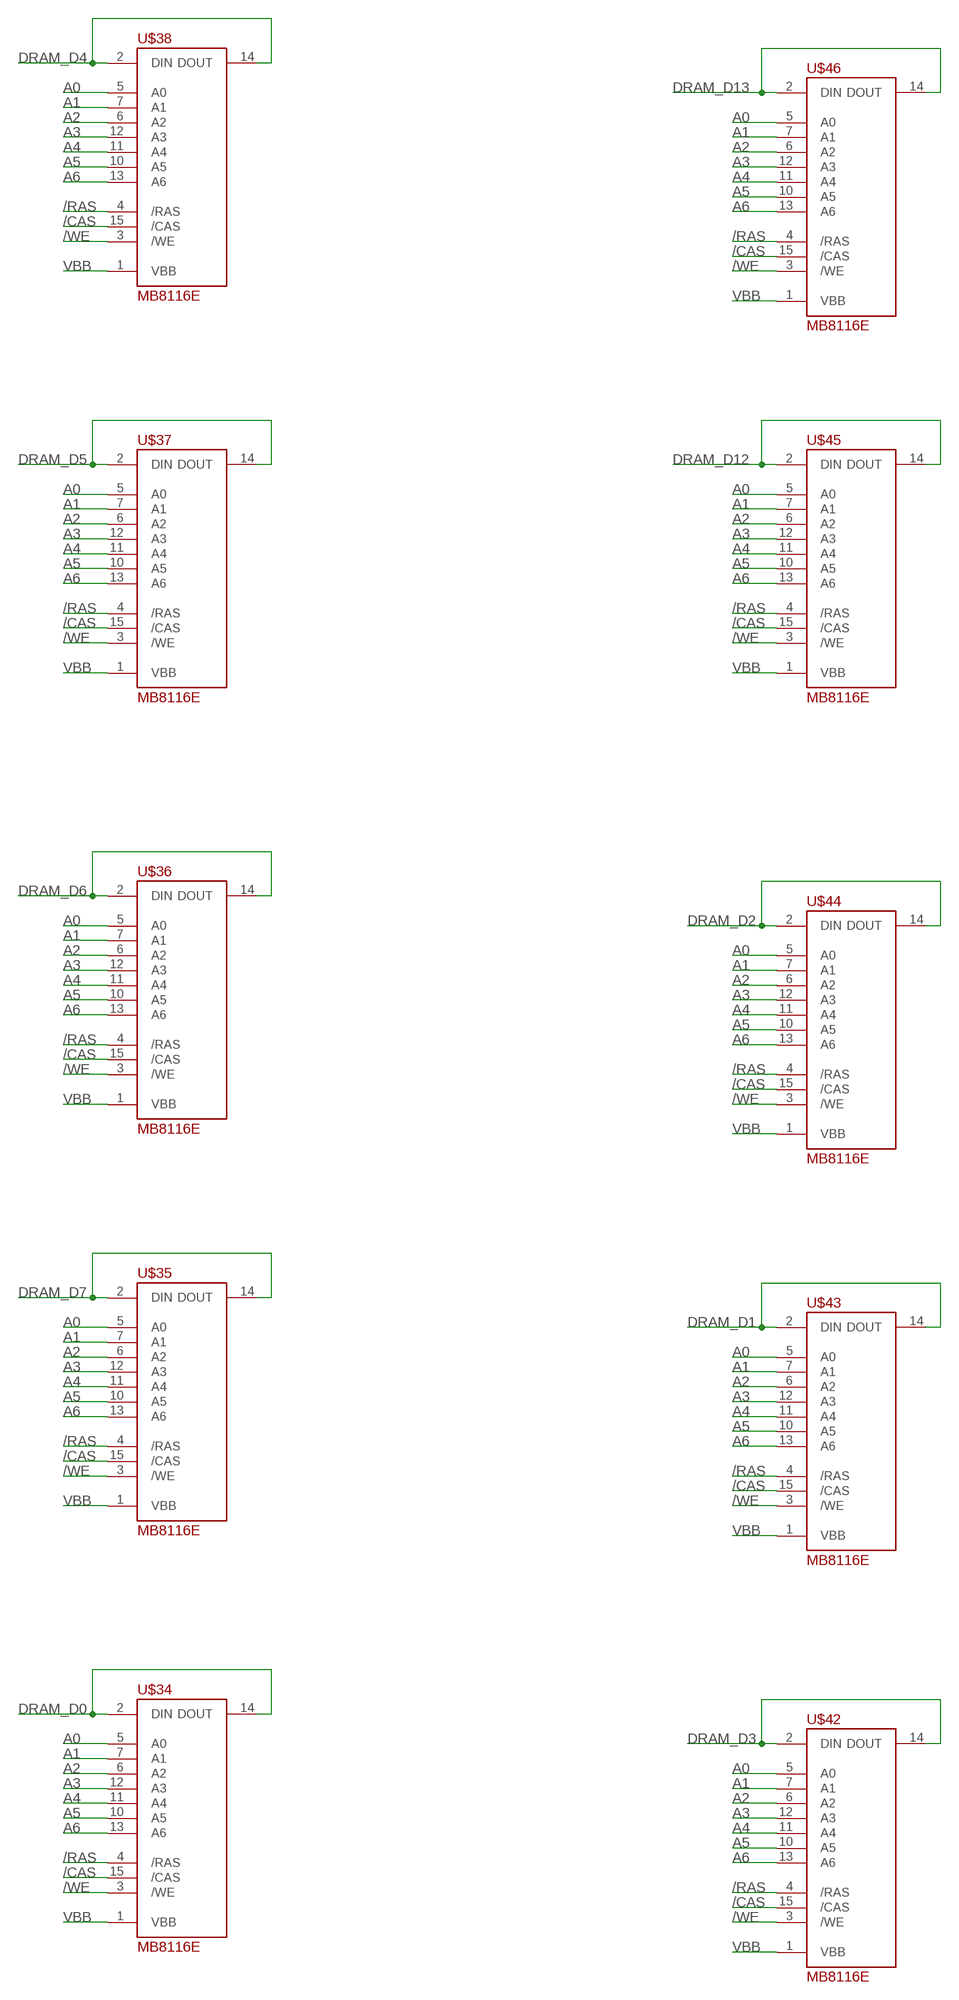
[diagram p10: schematic, sheet 2, part 5 of 7]
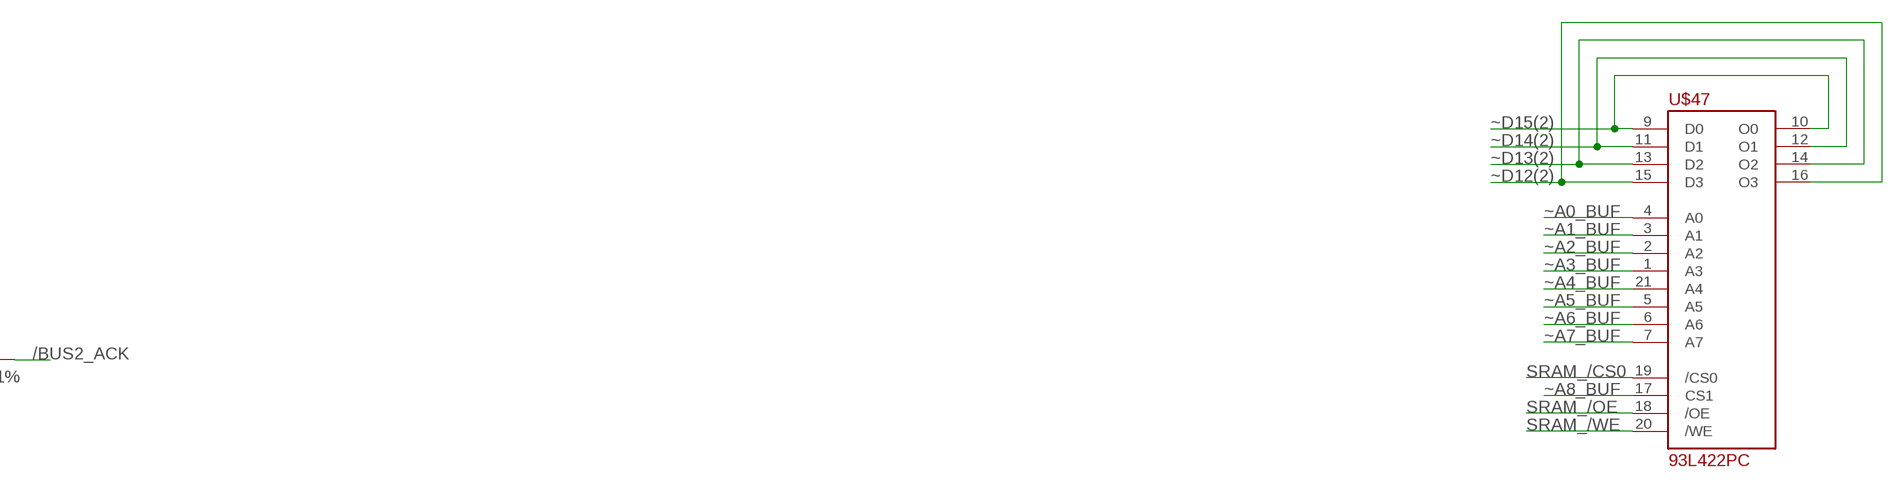
[diagram p11: schematic, sheet 2, part 6 of 7]
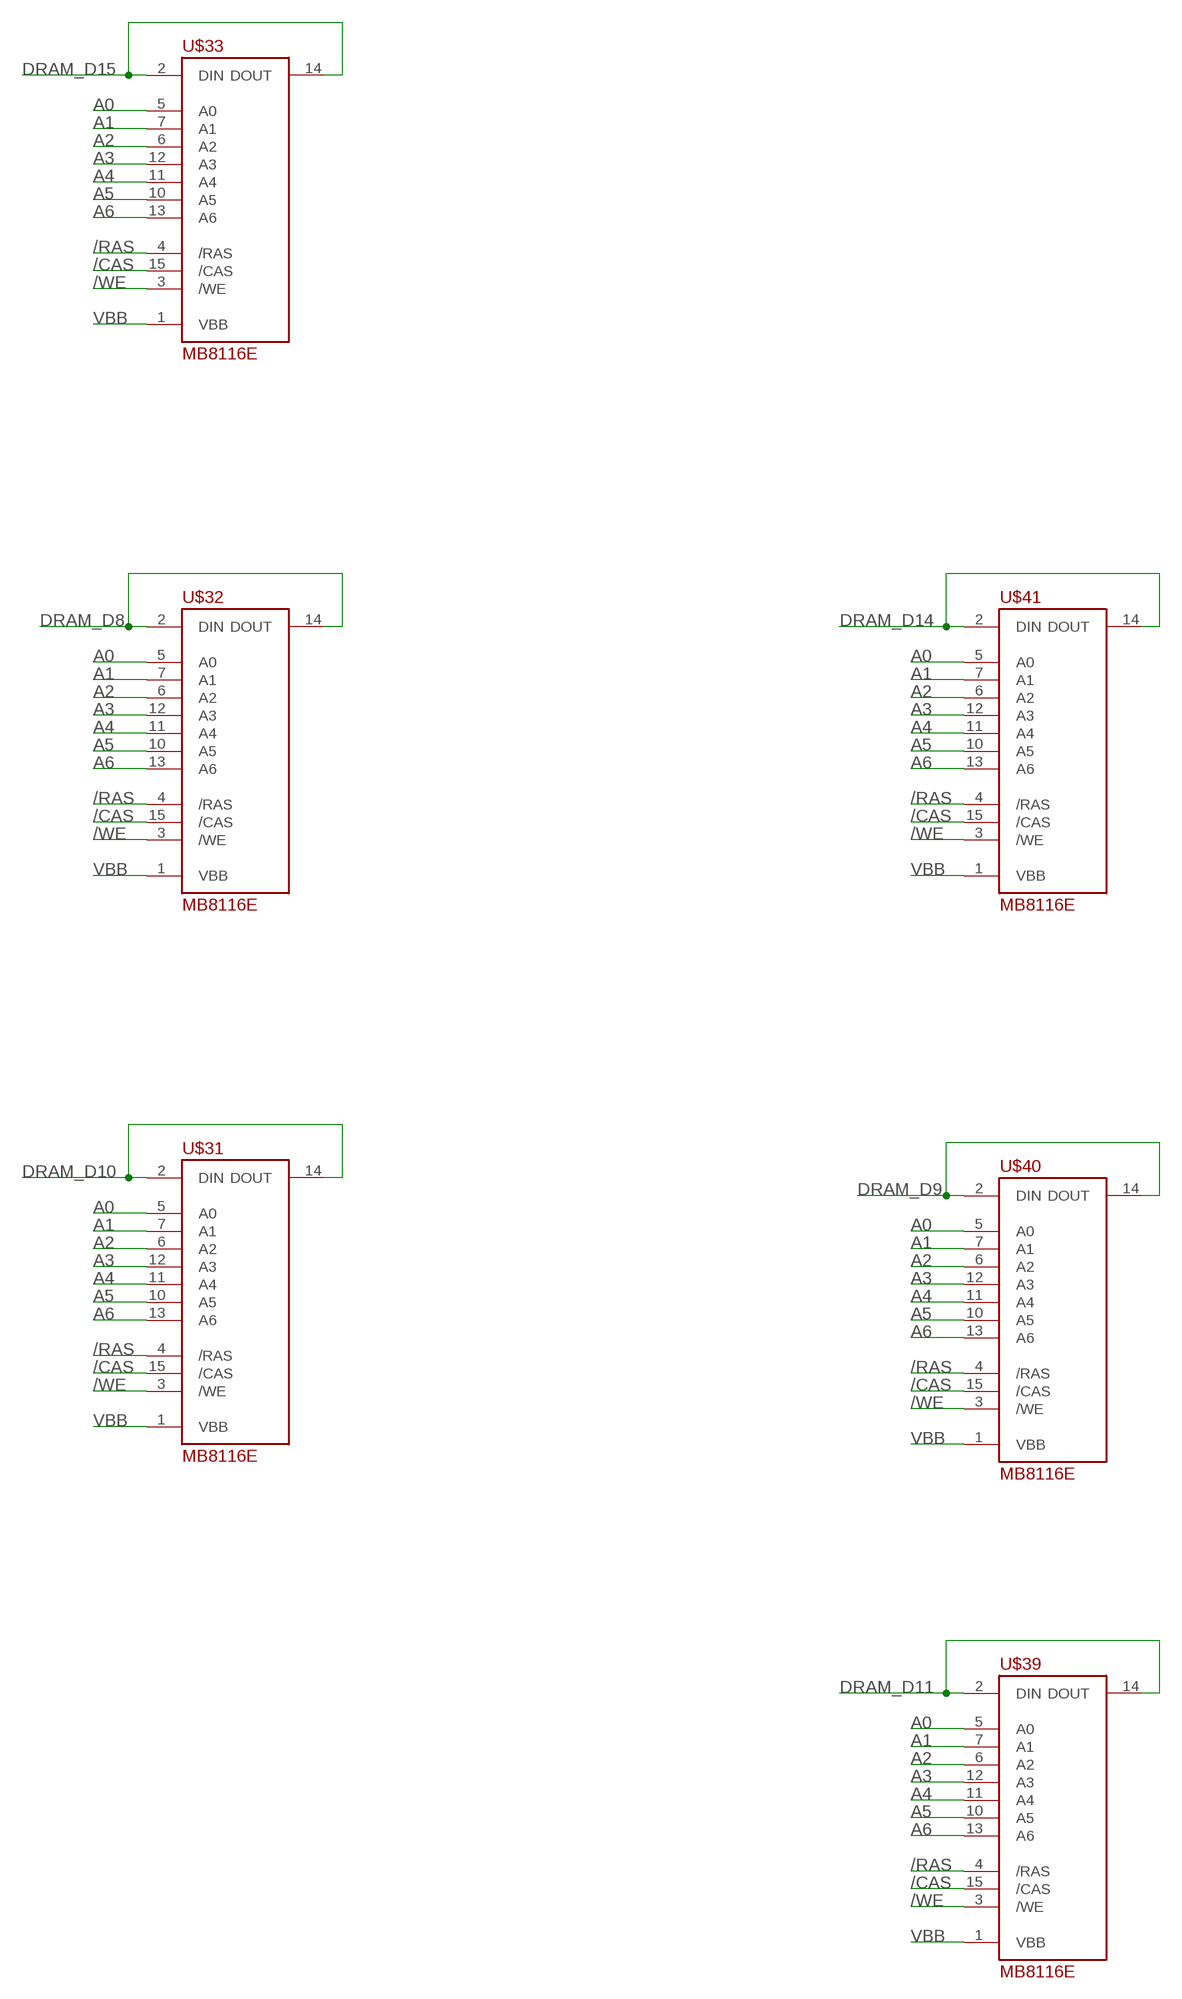
[diagram p12: schematic, sheet 2, part 7 of 7]

### Parts
C3  C-US075-032X103  [C075-032X103]
C4  C-US075-032X103  [C075-032X103]
D5  1N4004  [DO41-10]
D6  1N4004  [DO41-10]
D7  1N4004  [DO41-10]
D8  1N4004  [DO41-10]
IC18  74LS393N  [DIL14]
IC19  74LS74N  [DIL14]
IC20  74LS74N  [DIL14]
IC21  74S74N  [DIL14]
IC22  74LS26N  [DIL14]
IC23  74S138N  [DIL16]
IC24  74LS10N  [DIL14]
IC25  74LS14N  [DIL14]
IC26  74S174N  [DIL16]
IC27  74S174N  [DIL16]
IC28  74LS04N  [DIL14]
IC29  74S08N  [DIL14]
IC30  74LS00N  [DIL14]
IC31  74S20N  [DIL14]
IC32  74S04N  [DIL14]
IC33  74LS393N  [DIL14]
IC34  74S133N  [DIL16]
JP2  PINHD-1X3  [1X03]
JP3  PINHD-1X100  [1X100]
JP4  PINHD-1X100  [1X100]
Q3  2N3906  [TO92]
Q4  2N3904  [TO92]
R17  1k±1%  R-US_0207/7  [0207/7]
R18  1k±1%  R-US_0207/7  [0207/7]
R19  10k±1%  R-US_0207/7  [0207/7]
R20  1k±1%  R-US_0207/7  [0207/7]
R22  47.5±1%  R-US_0207/7  [0207/7]
R23  1k±1%  R-US_0207/7  [0207/7]
R24  1k±1%  R-US_0207/7  [0207/7]
R25  200±1%  R-US_0207/7  [0207/7]
R26  100±1%  R-US_0207/7  [0207/7]
R28  10±1%  R-US_0207/7  [0207/7]
R29  1k±1%  R-US_0207/7  [0207/7]
R30  1k±1%  R-US_0207/7  [0207/7]
R31  1k±1%  R-US_0207/7  [0207/7]
R32  1k±1%  R-US_0207/7  [0207/7]
R33  4.75k±1%  R-US_0207/7  [0207/7]
R34  1k±1%  R-US_0207/7  [0207/7]
U8  DM81LS97AN  [DIL20]
U9  DM81LS97AN  [DIL20]
U10  DM81LS97AN  [DIL20]
U11  DM81LS97AN  [DIL20]
U12  DM81LS97AN  [DIL20]
U13  DM81LS97AN  [DIL20]
U14  DM81LS97AN  [DIL20]
U$27  MC14012BCP  [DIL14]
U$28  MM80C97N  [DIL16]
U$29  SN74LS28N  [DIL14]
U$30  SN74LS40N  [DIL14]
U$31  MB8116E  [DIL16]
U$32  MB8116E  [DIL16]
U$33  MB8116E  [DIL16]
U$34  MB8116E  [DIL16]
U$35  MB8116E  [DIL16]
U$36  MB8116E  [DIL16]
U$37  MB8116E  [DIL16]
U$38  MB8116E  [DIL16]
U$39  MB8116E  [DIL16]
U$40  MB8116E  [DIL16]
U$41  MB8116E  [DIL16]
U$42  MB8116E  [DIL16]
U$43  MB8116E  [DIL16]
U$44  MB8116E  [DIL16]
U$45  MB8116E  [DIL16]
U$46  MB8116E  [DIL16]
U$47  93L422PC  [DIL22]
U$48  93L422PC  [DIL22]
U$49  93L422PC  [DIL22]
U$50  93L422PC  [DIL22]
U$51  1AB7-6001  [DIL20]
U$52  1AB7-6001  [DIL20]

### Nets
+12V: JP3.41 JP3.42 R19.2 R26.2
/BUS2_ACK: JP4.4 R22.2
/BUS_SEL: JP3.77 U$27.4(C)
/BUS_WRITE: JP3.56 U$27.9(A)
/CAS: U$30.8(Z) U$31.15(/CAS) U$32.15(/CAS) U$33.15(/CAS) U$34.15(/CAS) U$35.15(/CAS) U$36.15(/CAS) U$37.15(/CAS) U$38.15(/CAS) U$39.15(/CAS) U$40.15(/CAS) U$41.15(/CAS) U$42.15(/CAS) U$43.15(/CAS) U$44.15(/CAS) U$45.15(/CAS) U$46.15(/CAS) ; also sheet 1
/RAS: U$29.10(Z) U$31.4(/RAS) U$32.4(/RAS) U$33.4(/RAS) U$34.4(/RAS) U$35.4(/RAS) U$36.4(/RAS) U$37.4(/RAS) U$38.4(/RAS) U$39.4(/RAS) U$40.4(/RAS) U$41.4(/RAS) U$42.4(/RAS) U$43.4(/RAS) U$44.4(/RAS) U$45.4(/RAS) U$46.4(/RAS) ; also sheet 1
/WE: U$30.6(Z) U$31.3(/WE) U$32.3(/WE) U$33.3(/WE) U$34.3(/WE) U$35.3(/WE) U$36.3(/WE) U$37.3(/WE) U$38.3(/WE) U$39.3(/WE) U$40.3(/WE) U$41.3(/WE) U$42.3(/WE) U$43.3(/WE) U$44.3(/WE) U$45.3(/WE) U$46.3(/WE) ; also sheet 1
A0: U12.5(2Y) U13.5(2Y) U14.5(2Y) U$31.5(A0) U$32.5(A0) U$33.5(A0) U$34.5(A0) U$35.5(A0) U$36.5(A0) U$37.5(A0) U$38.5(A0) U$39.5(A0) U$40.5(A0) U$41.5(A0) U$42.5(A0) U$43.5(A0) U$44.5(A0) U$45.5(A0) U$46.5(A0) ; also sheet 1
A1: U12.7(3Y) U13.7(3Y) U14.7(3Y) U$31.7(A1) U$32.7(A1) U$33.7(A1) U$34.7(A1) U$35.7(A1) U$36.7(A1) U$37.7(A1) U$38.7(A1) U$39.7(A1) U$40.7(A1) U$41.7(A1) U$42.7(A1) U$43.7(A1) U$44.7(A1) U$45.7(A1) U$46.7(A1) ; also sheet 1
A2: U12.9(4Y) U13.9(4Y) U14.9(4Y) U$31.6(A2) U$32.6(A2) U$33.6(A2) U$34.6(A2) U$35.6(A2) U$36.6(A2) U$37.6(A2) U$38.6(A2) U$39.6(A2) U$40.6(A2) U$41.6(A2) U$42.6(A2) U$43.6(A2) U$44.6(A2) U$45.6(A2) U$46.6(A2) ; also sheet 1
A3: U12.17(8Y) U13.17(8Y) U14.17(8Y) U$31.12(A3) U$32.12(A3) U$33.12(A3) U$34.12(A3) U$35.12(A3) U$36.12(A3) U$37.12(A3) U$38.12(A3) U$39.12(A3) U$40.12(A3) U$41.12(A3) U$42.12(A3) U$43.12(A3) U$44.12(A3) U$45.12(A3) U$46.12(A3) ; also sheet 1
A4: U12.15(7Y) U13.15(7Y) U14.15(7Y) U$31.11(A4) U$32.11(A4) U$33.11(A4) U$34.11(A4) U$35.11(A4) U$36.11(A4) U$37.11(A4) U$38.11(A4) U$39.11(A4) U$40.11(A4) U$41.11(A4) U$42.11(A4) U$43.11(A4) U$44.11(A4) U$45.11(A4) U$46.11(A4) ; also sheet 1
A5: U12.13(6Y) U13.13(6Y) U14.13(6Y) U$31.10(A5) U$32.10(A5) U$33.10(A5) U$34.10(A5) U$35.10(A5) U$36.10(A5) U$37.10(A5) U$38.10(A5) U$39.10(A5) U$40.10(A5) U$41.10(A5) U$42.10(A5) U$43.10(A5) U$44.10(A5) U$45.10(A5) U$46.10(A5) ; also sheet 1
A6: U12.11(5Y) U13.11(5Y) U14.11(5Y) U$31.13(A6) U$32.13(A6) U$33.13(A6) U$34.13(A6) U$35.13(A6) U$36.13(A6) U$37.13(A6) U$38.13(A6) U$39.13(A6) U$40.13(A6) U$41.13(A6) U$42.13(A6) U$43.13(A6) U$44.13(A6) U$45.13(A6) U$46.13(A6) ; also sheet 1
BUS2_READ: IC25.5(F:I) JP4.6
BUS2_REQ: IC25.3(E:I) JP4.2
BUS_A2: JP3.48 U$27.11(C)
BUS_CLK: IC18.1(A:A) JP3.78
BUS_CLK_D4: IC18.4(A:QB) IC19.3(A:CLK)
BUS_CLK_D16: IC18.6(A:QD) IC22.12(D:I0) IC22.13(D:I1)
BUS_CLK_X12: IC25.1(D:I) JP3.83
DRAM_CYC1: IC26.6(D3) IC27.10(Q4) IC29.5(B:I1)
DRAM_CYC2: IC26.7(Q3) IC27.6(D3) IC28.5(C:I) U$30.4(C)
DRAM_CYC3: IC26.4(D2) IC27.7(Q3)
DRAM_CYC4: IC26.5(Q2) IC27.4(D2) U$30.10(B)
DRAM_CYC5: IC26.14(D6) IC27.5(Q2)
DRAM_CYC6: IC22.9(C:I0) IC24.4(B:I1) IC26.15(Q6) IC27.14(D6) IC28.11(E:I)
DRAM_CYC7: IC26.13(D5) IC27.15(Q6)
DRAM_CYC8: IC26.12(Q5) IC27.13(D5)
DRAM_CYC9: IC20.2(A:D) IC27.12(Q5) IC28.3(B:I)
DRAM_D0: U10.12(5A) U11.11(5Y) U$34.2(DIN) U$34.14(DOUT)
DRAM_D1: U10.14(6A) U11.13(6Y) U$43.2(DIN) U$43.14(DOUT)
DRAM_D2: U10.16(7A) U11.15(7Y) U$44.2(DIN) U$44.14(DOUT)
DRAM_D3: U10.18(8A) U11.17(8Y) U$42.2(DIN) U$42.14(DOUT)
DRAM_D4: U10.8(4A) U11.9(4Y) U$38.2(DIN) U$38.14(DOUT)
DRAM_D5: U10.6(3A) U11.7(3Y) U$37.2(DIN) U$37.14(DOUT)
DRAM_D6: U10.4(2A) U11.5(2Y) U$36.2(DIN) U$36.14(DOUT)
DRAM_D7: U10.2(1A) U11.3(1Y) U$35.2(DIN) U$35.14(DOUT)
DRAM_D8: U8.12(5A) U9.11(5Y) U$32.2(DIN) U$32.14(DOUT)
DRAM_D9: U8.14(6A) U9.13(6Y) U$40.2(DIN) U$40.14(DOUT)
DRAM_D10: U8.16(7A) U9.15(7Y) U$31.2(DIN) U$31.14(DOUT)
DRAM_D11: U8.18(8A) U9.17(8Y) U$39.2(DIN) U$39.14(DOUT)
DRAM_D12: U8.8(4A) U9.9(4Y) U$45.2(DIN) U$45.14(DOUT)
DRAM_D13: U8.6(3A) U9.7(3Y) U$46.2(DIN) U$46.14(DOUT)
DRAM_D14: U8.4(2A) U9.5(2Y) U$41.2(DIN) U$41.14(DOUT)
DRAM_D15: U8.2(1A) U9.3(1Y) U$33.2(DIN) U$33.14(DOUT)
DRAM_EN: IC24.5(B:I2) IC24.9(C:I0) IC27.11(D4) IC29.4(B:I0) IC30.9(C:I0) IC30.12(D:I0) IC31.6(A:O) U14.1(/G1) U14.19(/G2) U$30.5(D) U$30.9(A)
GND: C3.2 D5.C D7.C IC18.2(A:CLR) IC23.3(C) IC33.2(A:CLR) IC33.12(B:CLR) JP3.1 JP3.86 JP4.1 JP4.3 JP4.5 JP4.7 JP4.9 JP4.11 JP4.13 JP4.16 JP4.33 JP4.34 Q3.3(E) U$28.2(1A) U$28.4(2A) U$28.6(3A) U$28.10(4A) U$28.12(5A) U$51.10 U$51.11 U$52.10 U$52.11 ; also sheet 1
J2.12: JP4.12 U$29.6(B) ; also sheet 1
N$25: U$27.1(Z) U$27.12(D)
N$27: IC19.1(A:CLR) IC19.13(B:CLR) IC20.13(B:CLR) IC22.3(A:O) R33.1
N$29: IC23.14(Y1) IC31.2(A:I1)
N$30: IC18.10(B:QB) IC22.1(A:I0) IC22.2(A:I1)
N$31: IC22.6(B:O) IC22.8(C:O) R22.1
N$34: IC25.4(E:O) IC25.11(B:I)
N$38: IC24.6(B:O) U8.1(/G1) U8.19(/G2) U10.1(/G1) U10.19(/G2)
N$39: IC30.11(D:O) U9.1(/G1) U9.19(/G2) U11.1(/G1) U11.19(/G2)
N$40: IC30.8(C:O) U12.1(/G1) U12.19(/G2)
N$64: IC24.8(C:O) U13.1(/G1) U13.19(/G2)
N$90: IC18.12(B:CLR) IC19.8(B:!Q)
N$131: IC19.11(B:CLK) IC20.9(B:Q)
N$132: IC19.6(A:!Q) U$29.5(A)
N$135: IC20.6(A:!Q) IC29.1(A:I0)
N$137: IC20.12(B:D) U$29.4(Z)
N$139: IC29.6(B:O) U$29.8(A)
N$140: IC21.8(B:!Q) IC22.5(B:I1)
N$144: IC22.4(B:I0) IC29.11(D:O)
N$148: IC23.5(G2B) IC30.6(B:O)
N$150: IC23.12(Y3) IC31.5(A:I3)
N$151: IC23.13(Y2) IC31.4(A:I2)
N$153: IC23.15(Y0) JP2.1
N$154: IC31.1(A:I0) JP2.2
N$155: JP2.3 R23.2
N$163: IC26.1(CLR) IC27.1(CLR) IC29.3(A:O)
N$187: C3.1 D6.A R25.2
N$188: C4.2 D6.C D7.A
N$189: C4.1 D8.A Q4.3(E) R28.1
N$190: Q4.1(C) R26.1
N$191: Q3.1(C) R28.2
N$199: R29.2 U14.2(1A)
N$200: R30.2 U13.2(1A)
N$208: R31.2 U12.2(1A)
N$219: U$27.13(Z) U$28.1(DIS1) U$28.15(DIS2)
PU1: IC19.2(A:D) IC19.4(A:PRE) IC19.10(B:PRE) IC19.12(B:D) IC20.10(B:PRE) R17.2
PU2: IC20.4(A:PRE) R20.2
PU3: IC20.1(A:CLR) R34.2
PU4: IC34.11(I8) IC34.12(I9) IC34.15(I12) R32.2
PU5: IC21.10(B:PRE) R18.2
PU6: R24.2 U$30.2(B) U$30.12(C) U$30.13(D)
REF_A0: IC33.6(A:QD) IC33.13(B:A) U14.4(2A)
REF_A1: IC33.4(A:QB) U14.6(3A)
REF_A2: IC33.5(A:QC) U14.8(4A)
REF_A3: IC33.3(A:QA) U14.18(8A)
REF_A4: IC33.11(B:QA) U14.16(7A)
REF_A5: IC33.10(B:QB) U14.14(6A)
REF_A6: IC33.9(B:QC) U14.12(5A)
REQ_CYC1: IC26.2(Q1) IC27.3(D1) IC29.12(D:I0) IC34.2(I1)
REQ_CYC2: IC23.6(G1) IC26.11(D4) IC27.2(Q1) IC31.12(B:I2)
REQ_CYC3: IC21.12(B:D) IC26.10(Q4) IC32.3(B:I)
SEQ_2: JP3.54 U$27.10(B)
SPEC_CLK: IC19.9(B:Q) IC33.1(A:A) U$29.9(B)
SRAM_/CS0: IC32.5(C:I) IC34.9(O) U$47.19(/CS0) U$48.19(/CS0) U$49.19(/CS0) U$50.19(/CS0) ; also sheet 1
SRAM_/OE: IC30.3(A:O) U$47.18(/OE) U$48.18(/OE) U$49.18(/OE) U$50.18(/OE) ; also sheet 1
SRAM_/WE: IC31.8(B:O) U$47.20(/WE) U$48.20(/WE) U$49.20(/WE) U$50.20(/WE) ; also sheet 1
VBB: D5.A R25.1 U$31.1(VBB) U$32.1(VBB) U$33.1(VBB) U$34.1(VBB) U$35.1(VBB) U$36.1(VBB) U$37.1(VBB) U$38.1(VBB) U$39.1(VBB) U$40.1(VBB) U$41.1(VBB) U$42.1(VBB) U$43.1(VBB) U$44.1(VBB) U$45.1(VBB) U$46.1(VBB) ; also sheet 1
VCC: JP3.2 JP3.3 JP3.4 JP3.43 JP3.44 JP3.85 R17.1 R18.1 R20.1 R23.1 R24.1 R29.1 R30.1 R31.1 R32.1 R33.2 R34.1 U$27.2(A) U$27.3(B) U$27.5(D) U$28.14(6A) U$51.1 U$51.20 U$52.1 U$52.20 ; also sheet 1
~A0: JP4.50 U$51.9
~A0_BUF: U12.4(2A) U$47.4(A0) U$48.4(A0) U$49.4(A0) U$50.4(A0) U$51.12
~A1: JP4.49 U$51.8
~A1_BUF: U12.6(3A) U$47.3(A1) U$48.3(A1) U$49.3(A1) U$50.3(A1) U$51.13
~A2: JP4.48 U$51.7
~A2_BUF: U12.8(4A) U$47.2(A2) U$48.2(A2) U$49.2(A2) U$50.2(A2) U$51.14
~A3: JP4.47 U$51.6
~A3_BUF: U12.18(8A) U$47.1(A3) U$48.1(A3) U$49.1(A3) U$50.1(A3) U$51.15
~A4: JP4.46 U$51.5
~A4_BUF: U12.16(7A) U$47.21(A4) U$48.21(A4) U$49.21(A4) U$50.21(A4) U$51.16
~A5: JP4.45 U$51.4
~A5_BUF: U12.14(6A) U$47.5(A5) U$48.5(A5) U$49.5(A5) U$50.5(A5) U$51.17
~A6: JP4.44 U$51.3
~A6_BUF: U12.12(5A) U$47.6(A6) U$48.6(A6) U$49.6(A6) U$50.6(A6) U$51.18
~A7: JP4.43 U$51.2
~A7_BUF: U13.4(2A) U$47.7(A7) U$48.7(A7) U$49.7(A7) U$50.7(A7) U$51.19
~A8: JP4.42 U$52.9
~A8_BUF: IC34.10(I7) U13.6(3A) U$47.17(CS1) U$48.17(CS1) U$49.17(CS1) U$50.17(CS1) U$52.12
~A9: JP4.41 U$52.8
~A9_BUF: IC34.7(I6) U13.8(4A) U$52.13
~A10: JP4.40 U$52.7
~A10_BUF: IC34.6(I5) U13.18(8A) U$52.14
~A11: JP4.39 U$52.6
~A11_BUF: IC34.5(I4) U13.16(7A) U$52.15
~A12: JP4.38 U$52.5
~A12_BUF: IC23.1(A) IC34.13(I10) U13.14(6A) U$52.16
~A13: JP4.37 U$52.4
~A13_BUF: IC23.2(B) IC34.4(I3) U13.12(5A) U$52.17
~A14: JP4.36 U$52.3
~A14_BUF: IC30.4(B:I0) IC34.3(I2) U$52.18
~A15: JP4.35 U$52.2
~A15_BUF: IC30.5(B:I1) IC34.1(I0) U$52.19
~BUS2_READ: IC25.6(F:O) IC25.9(C:I) IC30.13(D:I1) IC31.13(B:I3) U$30.1(A)
~BUS_CLK_D16: D8.C IC22.11(D:O) Q3.2(B) Q4.2(B) R19.1
~BUS_CLK_X12: IC18.13(B:A) IC20.3(A:CLK) IC25.2(D:O) IC26.9(CLK) IC32.1(A:I)
~D0(2): JP4.32 U10.11(5Y) U11.12(5A) U$50.15(D3) U$50.16(O3)
~D1(2): JP4.31 U10.13(6Y) U11.14(6A) U$50.13(D2) U$50.14(O2)
~D2(2): JP4.30 U10.15(7Y) U11.16(7A) U$50.9(D0) U$50.10(O0)
~D3(2): JP4.29 U10.17(8Y) U11.18(8A) U$50.11(D1) U$50.12(O1)
~D4(2): JP4.28 U10.9(4Y) U11.8(4A) U$49.15(D3) U$49.16(O3)
~D5(2): JP4.27 U10.7(3Y) U11.6(3A) U$49.13(D2) U$49.14(O2)
~D6(2): JP4.26 U10.5(2Y) U11.4(2A) U$49.9(D0) U$49.10(O0)
~D7(2): JP4.25 U10.3(1Y) U11.2(1A) U$49.11(D1) U$49.12(O1)
~D8(2): JP4.24 U8.11(5Y) U9.12(5A) U$48.15(D3) U$48.16(O3) ; also sheet 1
~D9(2): JP4.23 U8.13(6Y) U9.14(6A) U$48.13(D2) U$48.14(O2) ; also sheet 1
~D10: JP3.55 U$28.9(4Y)
~D10(2): JP4.22 U8.15(7Y) U9.16(7A) U$48.11(D1) U$48.12(O1)
~D11: JP3.53 U$28.11(5Y)
~D11(2): JP4.21 U8.17(8Y) U9.18(8A) U$48.9(D0) U$48.10(O0)
~D12(2): JP4.20 U8.9(4Y) U9.8(4A) U$47.15(D3) U$47.16(O3) ; also sheet 1
~D13: JP3.49 U$28.7(3Y)
~D13(2): JP4.19 U8.7(3Y) U9.6(3A) U$47.13(D2) U$47.14(O2) ; also sheet 1
~D14: JP3.47 U$28.5(2Y)
~D14(2): JP4.18 U8.5(2Y) U9.4(2A) U$47.11(D1) U$47.12(O1) ; also sheet 1
~D15: JP3.45 U$28.3(1Y)
~D15(2): JP4.17 U8.3(1Y) U9.2(1A) U$47.9(D0) U$47.10(O0) ; also sheet 1
~DRAM_CYC2: IC28.6(C:O) IC28.9(D:I) IC30.10(C:I1)
~DRAM_CYC6: IC24.11(C:I2) IC28.10(E:O)
~DRAM_CYC9: IC22.10(C:I1) IC28.4(B:O)
~REQ_CYC3: IC31.10(B:I1) IC32.4(B:O)
~SRAM_/CS0: IC21.13(B:CLR) IC23.4(G2A) IC29.13(D:I1) IC30.1(A:I0) IC31.9(B:I0) IC32.6(C:O)
~~BUS2_READ: IC24.3(B:I0) IC25.8(C:O) IC30.2(A:I1)
~~BUS2_REQ: IC25.10(B:O) IC26.3(D1) IC29.2(A:I1) IC34.14(I11)
~~BUS_CLK_X12: IC20.11(B:CLK) IC21.11(B:CLK) IC27.9(CLK) IC32.2(A:O)
~~DRAM_CYC2: IC24.10(C:I1) IC28.8(D:O)
Unconnected: IC18.3(A:QA) IC18.5(A:QC) IC18.8(B:QD) IC18.9(B:QC) IC18.11(B:QA) IC19.5(A:Q) IC20.5(A:Q) IC20.8(B:!Q) IC21.1(A:CLR) IC21.2(A:D) IC21.3(A:CLK) IC21.4(A:PRE) IC21.5(A:Q) IC21.6(A:!Q) IC21.9(B:Q) IC23.7(Y7) IC23.9(Y6) IC23.10(Y5) IC23.11(Y4) IC24.1(A:I0) IC24.2(A:I1) IC24.12(A:O) IC24.13(A:I2) IC25.12(A:O) IC25.13(A:I) IC28.1(A:I) IC28.2(A:O) IC28.12(F:O) IC28.13(F:I) IC29.8(C:O) IC29.9(C:I0) IC29.10(C:I1) IC32.8(D:O) IC32.9(D:I) IC32.10(E:O) IC32.11(E:I) IC32.12(F:O) IC32.13(F:I) IC33.8(B:QD) JP3.5 JP3.6 JP3.7 JP3.8 JP3.9 JP3.10 JP3.11 JP3.12 JP3.13 JP3.14 JP3.15 JP3.16 JP3.17 JP3.18 JP3.19 JP3.20 JP3.21 JP3.22 JP3.23 JP3.24 JP3.25 JP3.26 JP3.27 JP3.28 JP3.29 JP3.30 JP3.31 JP3.32 JP3.33 JP3.34 JP3.35 JP3.36 JP3.37 JP3.38 JP3.39 JP3.40 JP3.46 JP3.50 JP3.51 JP3.52 JP3.57 JP3.58 JP3.59 JP3.60 JP3.61 JP3.62 JP3.63 JP3.64 JP3.65 JP3.66 JP3.67 JP3.68 JP3.69 JP3.70 JP3.71 JP3.72 JP3.73 JP3.74 JP3.75 JP3.76 JP3.79 JP3.80 JP3.81 JP3.82 JP3.84 JP3.87 JP3.88 JP3.89 JP3.90 JP3.91 JP3.92 JP3.93 JP3.94 JP3.95 JP3.96 JP3.97 JP3.98 JP3.99 JP3.100 JP4.8 JP4.10 JP4.14 JP4.15 JP4.51 JP4.52 JP4.53 JP4.54 JP4.55 JP4.56 JP4.57 JP4.58 JP4.59 JP4.60 JP4.61 JP4.62 JP4.63 JP4.64 JP4.65 JP4.66 JP4.67 JP4.68 JP4.69 JP4.70 JP4.71 JP4.72 JP4.73 JP4.74 JP4.75 JP4.76 JP4.77 JP4.78 JP4.79 JP4.80 JP4.81 JP4.82 JP4.83 JP4.84 JP4.85 JP4.86 JP4.87 JP4.88 JP4.89 JP4.90 JP4.91 JP4.92 JP4.93 JP4.94 JP4.95 JP4.96 JP4.97 JP4.98 JP4.99 JP4.100 U12.3(1Y) U13.3(1Y) U14.3(1Y) U$28.13(6Y) U$29.1(Z) U$29.2(A) U$29.3(B) U$29.11(A) U$29.12(B) U$29.13(Z)

## Power pins joined to a net without a drawn wire
GND: IC1.7(P:GND) IC2.7(P:GND) IC3.7(P:GND) IC4.7(P:GND) IC5.7(P:GND) IC6.8(GND) IC7.7(P:GND) IC8.7(P:GND) IC9.8(GND) IC10.8(GND) IC11.7(P:GND) IC12.7(P:GND) IC13.7(P:GND) IC14.7(P:GND) IC15.7(P:GND) IC16.7(P:GND) IC17.8(GND) IC18.7(P:GND) IC19.7(P:GND) IC20.7(P:GND) IC21.7(P:GND) IC22.7(P:GND) IC23.8(GND) IC24.7(P:GND) IC25.7(P:GND) IC26.8(GND) IC27.8(GND) IC28.7(P:GND) IC29.7(P:GND) IC30.7(P:GND) IC31.7(P:GND) IC32.7(P:GND) IC33.7(P:GND) IC34.8(GND)
VCC: IC1.14(P:VCC) IC2.14(P:VCC) IC3.14(P:VCC) IC4.14(P:VCC) IC5.14(P:VCC) IC6.16(VCC) IC7.14(P:VCC) IC8.14(P:VCC) IC9.16(VCC) IC10.16(VCC) IC11.14(P:VCC) IC12.14(P:VCC) IC13.14(P:VCC) IC14.14(P:VCC) IC15.14(P:VCC) IC16.14(P:VCC) IC17.16(VCC) IC18.14(P:VCC) IC19.14(P:VCC) IC20.14(P:VCC) IC21.14(P:VCC) IC22.14(P:VCC) IC23.16(VCC) IC24.14(P:VCC) IC25.14(P:VCC) IC26.16(VCC) IC27.16(VCC) IC28.14(P:VCC) IC29.14(P:VCC) IC30.14(P:VCC) IC31.14(P:VCC) IC32.14(P:VCC) IC33.14(P:VCC) IC34.16(VCC)

## Library data of the parts
C1-C4 = resistor:C-US: CAPACITOR, American symbol
D1-D8 = diode:1N4004: DIODE general purpose rectifier, 1 A
IC1 IC16 IC18 IC33 = 74xx-us:74*393: Dual 4-bit decade and binary COUNTER
IC2-IC4 IC19-IC21 = 74xx-us:74*74: Dual D type positive edge triggered FLIP FLOP, preset and clear
IC5 IC22 = 74xx-us:74*26: Quad 2-input high voltage interface NAND gate
IC6 IC23 = 74xx-us:74*138: 3-line to 8-line DECODER/DEMULTIPLEXER
IC7 IC24 = 74xx-us:74*10: Triple 3-input NAND gate
IC8 IC25 = 74xx-us:74*14: Hex schmitt trigger INVERTER
IC9 IC10 IC26 IC27 = 74xx-us:74*174: Hex D type FLIP FLOP, clear
IC11 IC15 IC28 IC32 = 74xx-us:74*04: Hex INVERTER
IC12 IC29 = 74xx-us:74*08: Quad 2-input AND gate
IC13 IC30 = 74xx-us:74*00: Quad 2-input NAND gate
IC14 IC31 = 74xx-us:74*20: Dual 4-input NAND gate
IC17 IC34 = 74xx-us:74*133: 13-input NAND gate
JP1 JP2 = adafruit:PINHD-1X3: PIN HEADER
JP3 JP4 = pinhead:PINHD-1X100: PIN HEADER 100 pol. Grid 2.54mm
Q1 Q3 = transistor-pnp:2N3906: PNP Transistor
Q2 Q4 = transistor-npn:2N3904: NPN Transistor
R1-R20 R22-R26 R28-R34 = resistor:R-US_: RESISTOR, American symbol
U1-U14 = User-Submitted:DM81LS97AN
U$1 U$27 = User-Submitted:MC14012BCP
U$2 U$28 = User-Submitted:MM80C97N
U$3 U$29 = User-Submitted:SN74LS28N
U$4 U$30 = User-Submitted:SN74LS40N
U$5-U$20 U$31-U$46 = User-Submitted:MB8116E
U$21-U$24 U$47-U$50 = User-Submitted:93L422PC
U$25 U$26 U$51 U$52 = User-Submitted:1AB7-6001